# EAGLE design board (EAGLE 9.3.2)
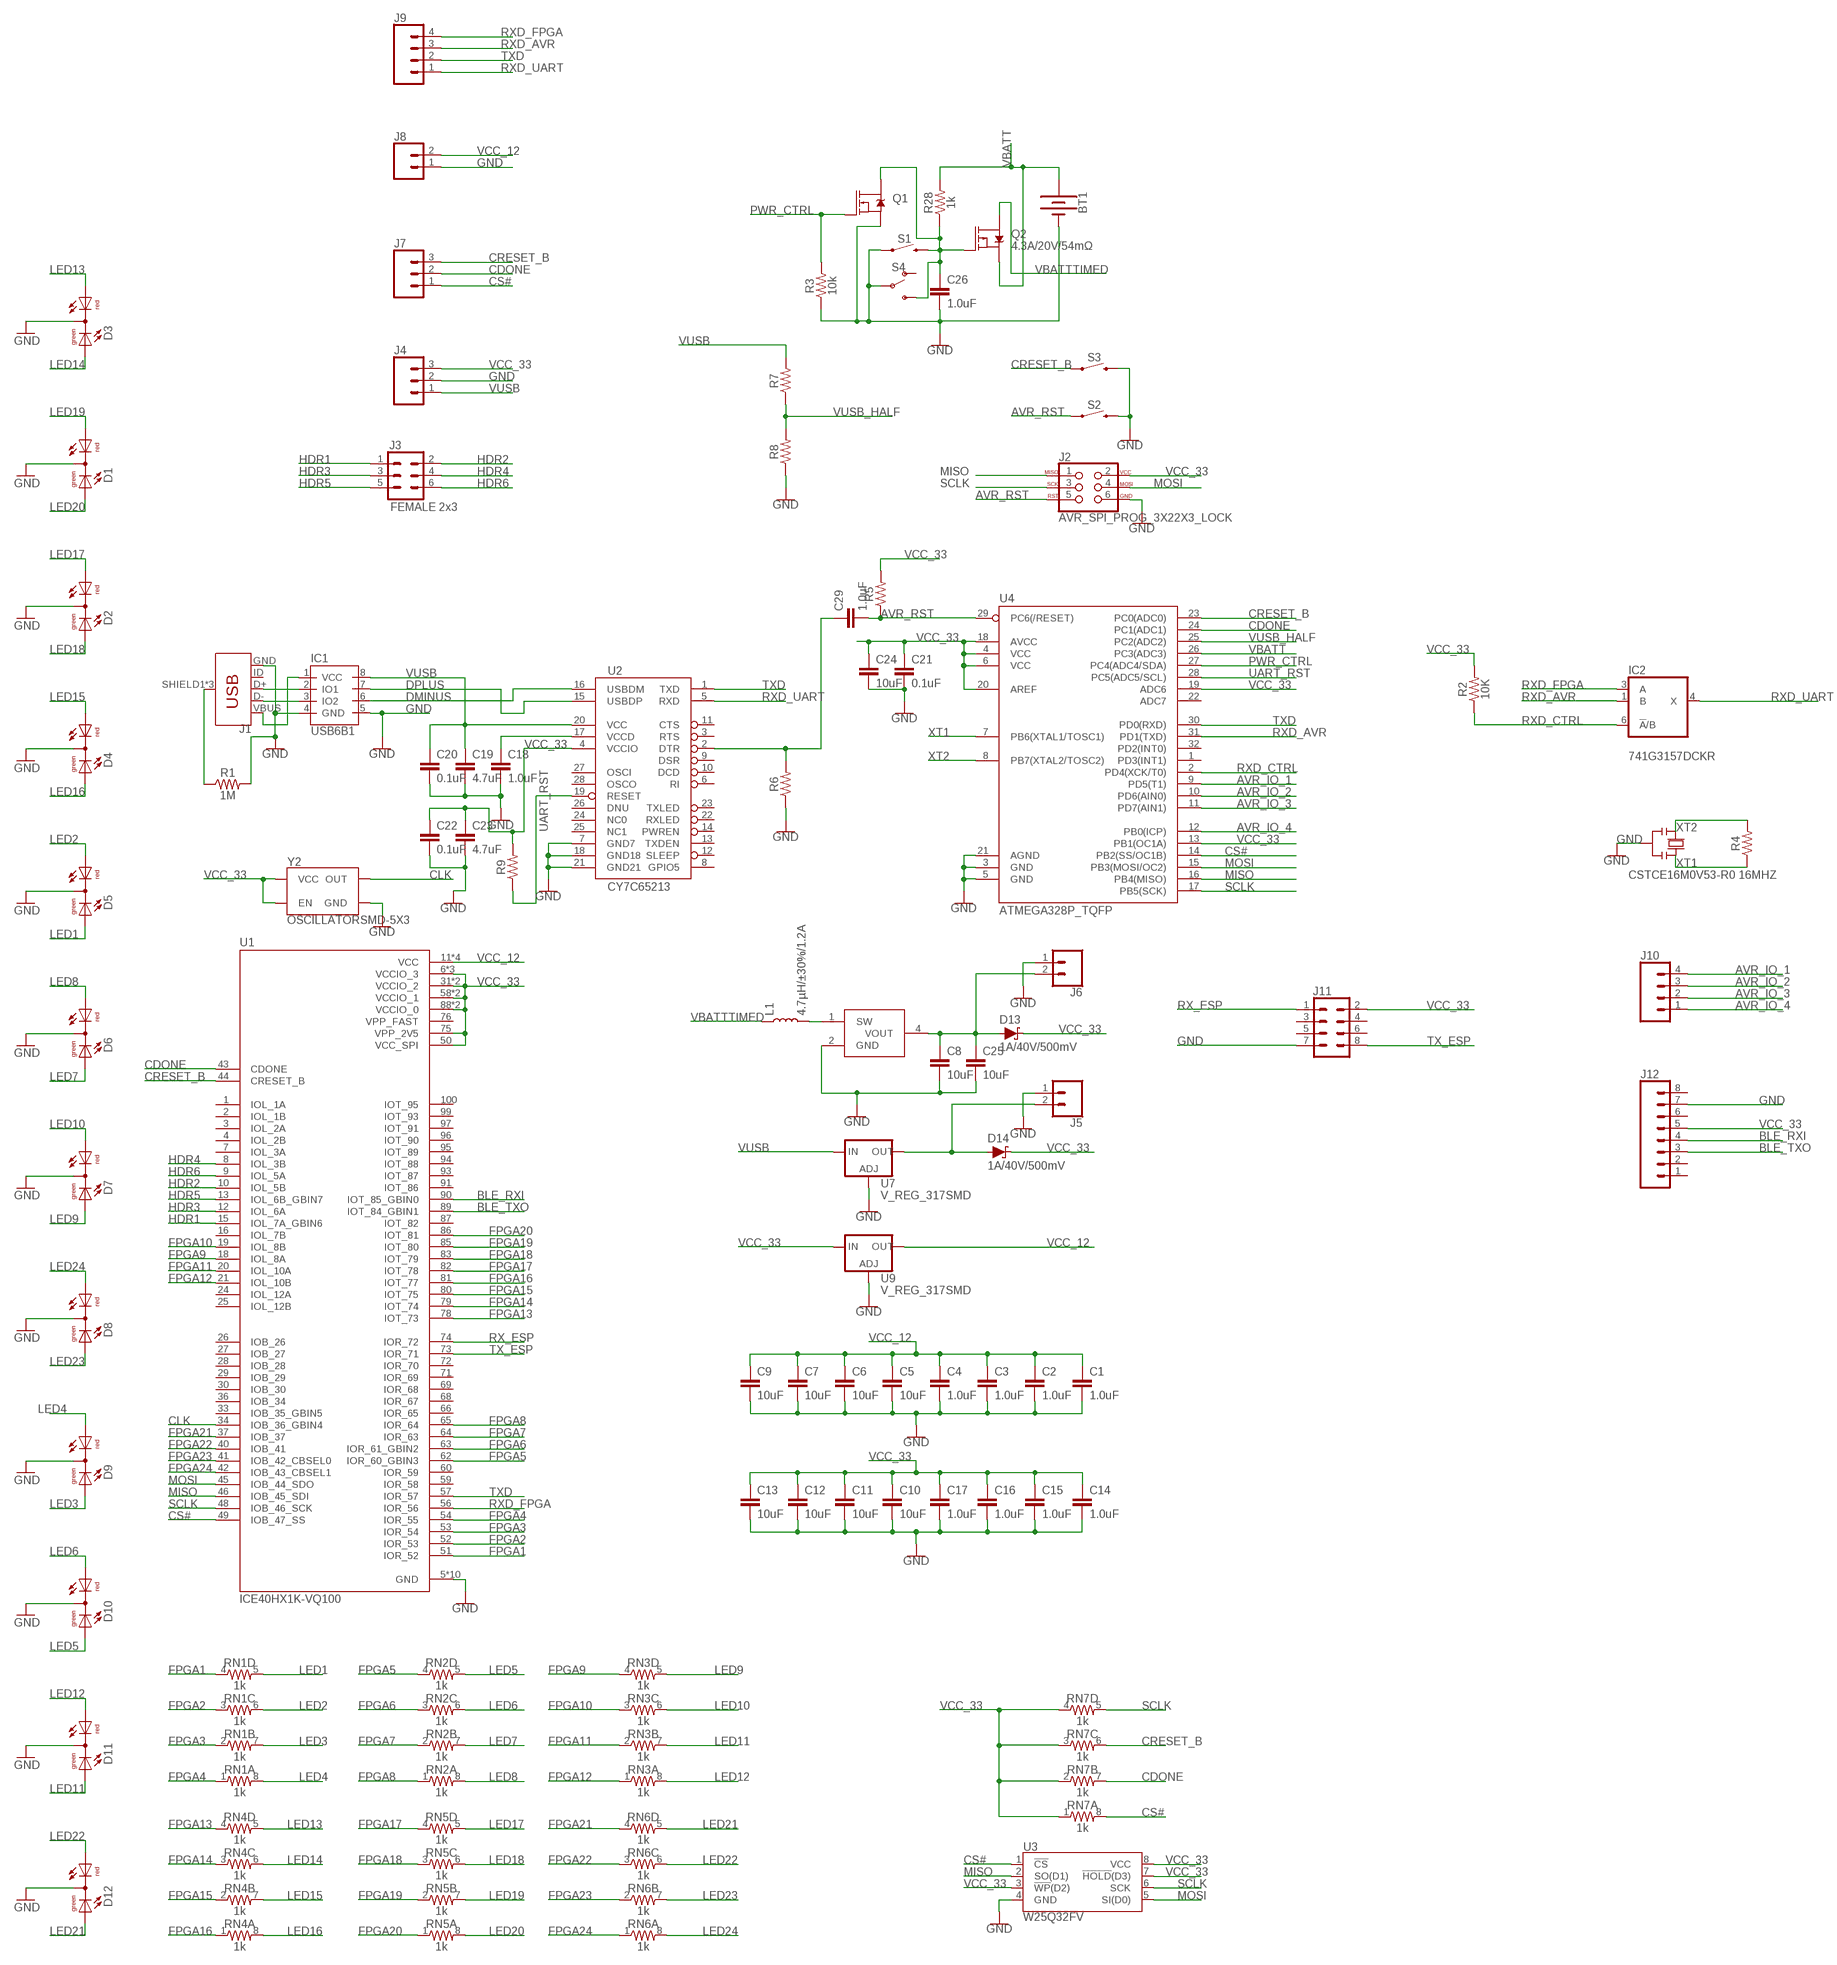
[diagram p0: schematic, sheet 1]

## Parts
BT1  BATTERY-20MM_SMD  [BATTCON_20MM]
C1  1.0uF  1.0UF-0805-25V-10%  [0805]
C2  1.0uF  1.0UF-0805-25V-10%  [0805]
C3  1.0uF  1.0UF-0805-25V-10%  [0805]
C4  1.0uF  1.0UF-0805-25V-10%  [0805]
C5  10uF  10UF-0805-10V-10%  [0805]
C6  10uF  10UF-0805-10V-10%  [0805]
C7  10uF  10UF-0805-10V-10%  [0805]
C8  10uF  22UF-0805-6.3V-20%  [0805]
C9  10uF  10UF-0805-10V-10%  [0805]
C10  10uF  10UF-0805-10V-10%  [0805]
C11  10uF  10UF-0805-10V-10%  [0805]
C12  10uF  10UF-0805-10V-10%  [0805]
C13  10uF  10UF-0805-10V-10%  [0805]
C14  1.0uF  1.0UF-0805-25V-(+80/-20%)  [0805]
C15  1.0uF  1.0UF-0805-25V-(+80/-20%)  [0805]
C16  1.0uF  1.0UF-0805-25V-(+80/-20%)  [0805]
C17  1.0uF  1.0UF-0805-25V-(+80/-20%)  [0805]
C18  1.0uF  1.0UF-0805-25V-10%  [0805]
C19  4.7uF  10UF-0805-10V-10%  [0805]
C20  0.1uF  1.0UF-0805-25V-10%  [0805]
C21  0.1uF  1.0UF-0805-25V-10%  [0805]
C22  0.1uF  1.0UF-0805-25V-10%  [0805]
C23  4.7uF  1.0UF-0805-25V-10%  [0805]
C24  10uF  1.0UF-0805-25V-10%  [0805]
C25  10uF  1.0UF-0805-25V-10%  [0805]
C26  1.0uF  1.0UF-0603-16V-10%  [0603]
C29  1.0uF  1.0UF-0805-25V-(+80/-20%)  [0805]
D1  DUOLED5MM  [DUOLED5MM]
D2  DUOLED5MM  [DUOLED5MM]
D3  DUOLED5MM  [DUOLED5MM]
D4  DUOLED5MM  [DUOLED5MM]
D5  DUOLED5MM  [DUOLED5MM]
D6  DUOLED5MM  [DUOLED5MM]
D7  DUOLED5MM  [DUOLED5MM]
D8  DUOLED5MM  [DUOLED5MM]
D9  DUOLED5MM  [DUOLED5MM]
D10  DUOLED5MM  [DUOLED5MM]
D11  DUOLED5MM  [DUOLED5MM]
D12  DUOLED5MM  [DUOLED5MM]
D13  1A/40V/500mV  DIODE-SCHOTTKY-SS14  [SMA-DIODE]
D14  1A/40V/500mV  DIODE-SCHOTTKY-SS14  [SMA-DIODE]
IC1  USB6B1  [SO08]
IC2  741G3157DCKR  [DCK_R-PDSO-G6]
J1  USB_MICRO-B_FEMALE-SMT  [USB-B-MICRO-SMD]
J2  AVR_SPI_PROG_3X22X3_LOCK  [2X3_LOCK]
J3  FEMALE 2x3  CONN_03X2FEMALE  [2X3]
J4  CONN_03LOCK  [1X03_LOCK]
J5  CONN_02LOCK  [1X02_LOCK]
J6  CONN_02LOCK  [1X02_LOCK]
J7  CONN_03LOCK  [1X03_LOCK]
J8  CONN_02LOCK  [1X02_LOCK]
J9  CONN_04LOCK  [1X04_LOCK]
J10  CONN_04LOCK  [1X04_LOCK]
J11  CONN_04X2  [2X4]
J12  CONN_08LOCK  [1X08_LOCK]
L1  4.7µH/±30%/1.2A  INDUCTOR-CDRH-4.7UH  [INDUCTOR_4.7UH]
Q1  5.8A/30V/35mΩ  MOSFET-NCH-AO3404A  [SOT23-3]
Q2  4.3A/20V/54mΩ  MOSFET_PCH-IRLML2244  [SOT23-3]
R1  1M  RESISTOR0805  [0805]
R2  10K  RESISTOR0805  [0805]
R3  10k  RESISTOR0805  [0805]
R4  RESISTOR0805  [0805]
R5  RESISTOR0805  [0805]
R6  RESISTOR0805  [0805]
R7  RESISTOR0805  [0805]
R8  RESISTOR0805  [0805]
R9  RESISTOR0805  [0805]
R28  1k  1KOHM-0603-1/10W-1%  [0603]
RN1  1k  1KOHM-ARRAY(4)-0805_ARV-1/10W-5%  [0805-ARV]
RN2  1k  1KOHM-ARRAY(4)-0805_ARV-1/10W-5%  [0805-ARV]
RN3  1k  1KOHM-ARRAY(4)-0805_ARV-1/10W-5%  [0805-ARV]
RN4  1k  1KOHM-ARRAY(4)-0805_ARV-1/10W-5%  [0805-ARV]
RN5  1k  1KOHM-ARRAY(4)-0805_ARV-1/10W-5%  [0805-ARV]
RN6  1k  1KOHM-ARRAY(4)-0805_ARV-1/10W-5%  [0805-ARV]
RN7  1k  1KOHM-ARRAY(4)-0805_ARV-1/10W-5%  [0805-ARV]
S1  MOMENTARY-SWITCH-SPST-SMD-5.2MM  [TACTILE_SWITCH_SMD_5.2MM]
S2  MOMENTARY-SWITCH-SPST-SMD-5.2MM  [TACTILE_SWITCH_SMD_5.2MM]
S3  MOMENTARY-SWITCH-SPST-SMD-5.2MM  [TACTILE_SWITCH_SMD_5.2MM]
S4  SWITCH-SPDT-PTH-11.6X4.0MM  [SWITCH_SPDT_PTH_11.6X4.0MM]
U1  ICE40HX1K-VQ100  [QFP50P1600X1600X120-100N]
U2  CY7C65213  [SSOP28DB]
U3  W25Q32FV  W25Q32FVSS  [SOIC-8]
U4  ATMEGA328P_TQFP  [TQFP32-08]
U7  V_REG_317SMD  [SOT223]
U9  V_REG_317SMD  [SOT223]
U$2  TPS613221A  [SOT95P280X145-5N]
Y1  CSTCE16M0V53-R0 16MHZ  RESONATORMU  [RESONATOR]
Y2  OSCILLATORSMD-5X3  [OSCILLATOR-SMD-5X3.2]

## Nets
AVR_IO_1: J10.4 U4.9(PD5(T1))
AVR_IO_2: J10.3 U4.10(PD6(AIN0))
AVR_IO_3: J10.2 U4.11(PD7(AIN1))
AVR_IO_4: J10.1 U4.12(PB0(ICP))
AVR_RST: C29.2 J2.5 R5.1 S2.1 U4.29(PC6(/RESET))
BLE_RXI: J12.4 U1.90(IOT_85_GBIN0)
BLE_TXO: J12.3 U1.89(IOT_84_GBIN1)
CDONE: J7.2 RN7.7 U1.43(CDONE) U4.24(PC1(ADC1))
CLK: U1.34(IOB_36_GBIN4) Y2.3(OUT)
CRESET_B: J7.3 RN7.6 S3.1 U1.44(CRESET_B) U4.23(PC0(ADC0))
CS#: J7.1 RN7.8 U1.49(IOB_47_SS) U3.1(!CS!) U4.14(PB2(SS/OC1B))
DMINUS: IC1.6(IO2) U2.16(USBDM)
DPLUS: IC1.7(IO1) U2.15(USBDP)
FPGA1: RN1.4 U1.51(IOR_52)
FPGA2: RN1.3 U1.52(IOR_53)
FPGA3: RN1.2 U1.53(IOR_54)
FPGA4: RN1.1 U1.54(IOR_55)
FPGA5: RN2.4 U1.62(IOR_60_GBIN3)
FPGA6: RN2.3 U1.63(IOR_61_GBIN2)
FPGA7: RN2.2 U1.64(IOR_63)
FPGA8: RN2.1 U1.65(IOR_64)
FPGA9: RN3.4 U1.18(IOL_8A)
FPGA10: RN3.3 U1.19(IOL_8B)
FPGA11: RN3.2 U1.20(IOL_10A)
FPGA12: RN3.1 U1.21(IOL_10B)
FPGA13: RN4.4 U1.78(IOT_73)
FPGA14: RN4.3 U1.79(IOT_74)
FPGA15: RN4.2 U1.80(IOT_75)
FPGA16: RN4.1 U1.81(IOT_77)
FPGA17: RN5.4 U1.82(IOT_78)
FPGA18: RN5.3 U1.83(IOT_79)
FPGA19: RN5.2 U1.85(IOT_80)
FPGA20: RN5.1 U1.86(IOT_81)
FPGA21: RN6.4 U1.37(IOB_37)
FPGA22: RN6.3 U1.40(IOB_41)
FPGA23: RN6.2 U1.41(IOB_42_CBSEL0)
FPGA24: RN6.1 U1.42(IOB_43_CBSEL1)
GND: BT1.2(-) C1.2 C2.2 C3.2 C4.2 C5.2 C6.2 C7.2 C8.2 C9.2 C10.2 C11.2 C12.2 C13.2 C14.2 C15.2 C16.2 C17.2 C18.2 C19.2 C20.2 C21.2 C22.2 C23.2 C24.2 C25.2 C26.2 D1.K(C) D2.K(C) D3.K(C) D4.K(C) D5.K(C) D6.K(C) D7.K(C) D8.K(C) D9.K(C) D10.K(C) D11.K(C) D12.K(C) IC1.4(GND) IC1.5(GND) J1.GND J2.6 J4.2 J5.1 J6.1 J8.1 J11.7 J12.7 Q1.2(S) R1.2 R3.1 R6.1 R8.1 S1.1 S2.3 S3.3 S4.2(P) U1.5(GND) U1.17(GND) U1.23(GND) U1.32(GND) U1.39(GND) U1.47(GND) U1.55(GND) U1.70(GND) U1.84(GND) U1.98(GND) U2.7(GND7) U2.18(GND18) U2.21(GND21) U3.4(GND) U4.3(GND) U4.5(GND) U4.21(AGND) U7.1(ADJ) U9.1(ADJ) U$2.2(GND) Y1.2 Y2.2(GND)
HDR1: J3.1 U1.15(IOL_7A_GBIN6)
HDR2: J3.2 U1.10(IOL_5B)
HDR3: J3.3 U1.12(IOL_6A)
HDR4: J3.4 U1.8(IOL_3B)
HDR5: J3.5 U1.13(IOL_6B_GBIN7)
HDR6: J3.6 U1.9(IOL_5A)
LED1: D5.AG RN1.5
LED2: D5.AR RN1.6
LED3: D9.AG RN1.7
LED4: D9.AR RN1.8
LED5: D10.AG RN2.5
LED6: D10.AR RN2.6
LED7: D6.AG RN2.7
LED8: D6.AR RN2.8
LED9: D7.AG RN3.5
LED10: D7.AR RN3.6
LED11: D11.AG RN3.7
LED12: D11.AR RN3.8
LED13: D3.AR RN4.5
LED14: D3.AG RN4.6
LED15: D4.AR RN4.7
LED16: D4.AG RN4.8
LED17: D2.AR RN5.5
LED18: D2.AG RN5.6
LED19: D1.AR RN5.7
LED20: D1.AG RN5.8
LED21: D12.AG RN6.5
LED22: D12.AR RN6.6
LED23: D8.AG RN6.7
LED24: D8.AR RN6.8
MISO: J2.1 U1.46(IOB_45_SDI) U3.2(SO(D1)) U4.16(PB4(MISO))
MOSI: J2.4 U1.45(IOB_44_SDO) U3.5(SI(D0)) U4.15(PB3(MOSI/OC2))
N$1: C29.1 R6.2 U2.2(DTR)
N$2: C8.1 C25.1 D13.A J6.2 U$2.4(VOUT)
N$3: C18.1 U2.17(VCCD)
N$4: J1.SHIELD1(SHIELD) J1.SHIELD2(SHIELD) J1.SHIELD3(SHIELD) R1.1
N$6: C26.1 Q1.3(D) Q2.1(G) R28.1 S1.3 S4.3(S)
N$29: D14.A J5.2 U7.2(OUT)
N$30: IC1.2(IO1) J1.D+
N$31: IC1.3(IO2) J1.D-
N$32: L1.P$2 U$2.1(SW)
N$33: IC1.1(VCC) J1.VBUS
PWR_CTRL: Q1.1(G) R3.2 U4.27(PC4(ADC4/SDA))
RX_ESP: J11.1 U1.74(IOR_72)
RXD_AVR: IC2.1(B) J9.3 U4.31(PD1(TXD))
RXD_CTRL: IC2.6(!A!/B) R2.1 U4.2(PD4(XCK/T0))
RXD_FPGA: IC2.3(A) J9.4 U1.56(IOR_56)
RXD_UART: IC2.4(X) J9.1 U2.5(RXD)
SCLK: J2.3 RN7.5 U1.48(IOB_46_SCK) U3.6(SCK) U4.17(PB5(SCK))
TX_ESP: J11.8 U1.73(IOR_71)
TXD: J9.2 U1.57(IOR_57) U2.1(TXD) U4.30(PD0(RXD))
UART_RST: R9.1 U2.19(RESET) U4.28(PC5(ADC5/SCL))
VBATT: BT1.1(+) Q2.2(S) R28.2 U4.26(PC3(ADC3))
VBATTTIMED: L1.P$1 Q2.3(D)
VCC_12: C1.1 C2.1 C3.1 C4.1 C5.1 C6.1 C7.1 C9.1 J8.2 U1.11(VCC) U1.35(VCC) U1.61(VCC) U1.77(VCC) U9.2(OUT)
VCC_33: C10.1 C11.1 C12.1 C13.1 C14.1 C15.1 C16.1 C17.1 C21.1 C22.1 C23.1 C24.1 D13.C D14.C J2.2 J4.3 J11.2 J12.5 R2.2 R5.2 R9.2 RN7.1 RN7.2 RN7.3 RN7.4 U1.6(VCCIO_3) U1.14(VCCIO_3) U1.22(VCCIO_3) U1.31(VCCIO_2) U1.38(VCCIO_2) U1.50(VCC_SPI) U1.58(VCCIO_1) U1.67(VCCIO_1) U1.75(VPP_2V5) U1.88(VCCIO_0) U1.92(VCCIO_0) U2.4(VCCIO) U3.3(!WP!(D2)) U3.7(!HOLD!(D3)) U3.8(VCC) U4.4(VCC) U4.6(VCC) U4.13(PB1(OC1A)) U4.18(AVCC) U4.19(ADC6) U4.20(AREF) U9.3(IN) Y2.1(EN) Y2.4(VCC)
VUSB: C19.1 C20.1 IC1.8(VCC) J4.1 R7.2 U2.20(VCC) U7.3(IN)
VUSB_HALF: R7.1 R8.2 U4.25(PC2(ADC2))
XT1: R4.1 U4.7(PB6(XTAL1/TOSC1)) Y1.3
XT2: R4.2 U4.8(PB7(XTAL2/TOSC2)) Y1.1
Unconnected: J1.ID J11.3 J11.4 J11.5 J11.6 J12.1 J12.2 J12.6 J12.8 S4.1(O) U1.1(IOL_1A) U1.2(IOL_1B) U1.3(IOL_2A) U1.4(IOL_2B) U1.7(IOL_3A) U1.16(IOL_7B) U1.24(IOL_12A) U1.25(IOL_12B) U1.26(IOB_26) U1.27(IOB_27) U1.28(IOB_28) U1.29(IOB_29) U1.30(IOB_30) U1.33(IOB_35_GBIN5) U1.36(IOB_34) U1.59(IOR_58) U1.60(IOR_59) U1.66(IOR_65) U1.68(IOR_67) U1.69(IOR_68) U1.71(IOR_69) U1.72(IOR_70) U1.87(IOT_82) U1.91(IOT_86) U1.93(IOT_87) U1.94(IOT_88) U1.95(IOT_89) U1.96(IOT_90) U1.97(IOT_91) U1.99(IOT_93) U1.100(IOT_95) U2.3(RTS) U2.6(RI) U2.8(GPIO5) U2.9(DSR) U2.10(DCD) U2.11(CTS) U2.12(SLEEP) U2.13(TXDEN) U2.14(PWREN) U2.22(RXLED) U2.23(TXLED) U2.24(NC0) U2.26(DNU) U2.27(OSCI) U2.28(OSCO) U4.1(PD3(INT1)) U4.22(ADC7) U4.32(PD2(INT0))

## Power pins joined to a net without a drawn wire
GND: IC2.2(GND)
NC1: U2.25(NC1)
VCC_33: IC2.5(VCC)
VPP_FAST: U1.76(VPP_FAST)

## Library data of the parts
BT1 = SparkFun-Batteries:BATTERY: Battery - Single Cell A variety of battery chemistries, sizes, and footprints. Device List: 20MM_PTH - Coin Cell Battery Holder - 20mm (PTH) <https://www.sparkfun.com/products/783> 6.8MM_PTH - Coin Cell Battery Holder - 6.8MM(SMD) <https://www.digikey.com/product-detail/en/seiko-instruments/MS621FE-FL11E/728-1057-ND/1889208?WT.srch=1&gclid=CNOQ5a6LzdQCFZS2wAodXCkE0g> 12MM_SMD - Coin Cell Battery Holder - 12mm (SMD) <https://www.sparkfun.com/products/10592> 12MM_PTH - Coin Cell Battery Holder - 12mm (PTH) <https://www.sparkfun.com/products/7948> 20MM_SMD - 20mm Coin Cell Battery Holder (SMD) (2 legs) Used on the Big Time Watch Kit <https://www.sparkfun.com/products/11734> 20MM_SMD_4LEGS - Coin Cell Battery Holder - 20mm (SMD) <https://www.sparkfun.com/products/11892> 20MM_SMD_4LEGS_OVERPASTE - Coin Cell Battery Holder - 20mm (SMD) <https://www.sparkfun.com/products/11892> (Over-paste on the legs) 24.5MM_PTH - Coin Cell Battery Holder - 24.5mm (PTH) <https://www.sparkfun.com/products/8863> 9V - 9V Battery Holder - PC Mount Used on the SparkFun SparkPunk Sound Kit <https://www.sparkfun.com/products/11177> and SparkFun SparkPunk Sequencer Kit <https://www.sparkfun.com/products/12707> 18650 - Battery Holder - 18650 (PTH) <https://www.sparkfun.com/products/13113> AA - Battery Holder - 1xAA (PTH) <https://www.sparkfun.com/products/7949> AAA - Battery Holder - 1xAAA (PTH) <https://www.sparkfun.com/products/12718> AA_KIT - Battery Holder - 1xAA (PTH) <https://www.sparkfun.com/products/7949> Special kit package - pads only have exposed copper on one side of the board. AAA_KIT - Battery Holder - 1xAAA (PTH) <https://www.sparkfun.com/products/12718> Special kit package - pads only have exposed copper on one side of the board.; PROD_ID: BATT-11519
C1-C4 C18 = SparkFun-Capacitors:1.0UF: 1µF ceramic capacitors A capacitor is a passive two-terminal electrical component used to store electrical energy temporarily in an electric field.; PROD_ID: CAP-08064
C5-C7 C9-C13 = SparkFun-Capacitors:10UF: 10.0µF ceramic capacitors A capacitor is a passive two-terminal electrical component used to store electrical energy temporarily in an electric field.; PROD_ID: CAP-11330
C8 = SparkFun-Capacitors:22UF: 22µF ceramic capacitors A capacitor is a passive two-terminal electrical component used to store electrical energy temporarily in an electric field.; PROD_ID: CAP-08402; VALUE: 22uF
C14-C17 C29 = SparkFun-Capacitors:1.0UF: 1µF ceramic capacitors A capacitor is a passive two-terminal electrical component used to store electrical energy temporarily in an electric field.; PROD_ID: CAP-11625
C19 = SparkFun-Capacitors:10UF: 10.0µF ceramic capacitors A capacitor is a passive two-terminal electrical component used to store electrical energy temporarily in an electric field.; PROD_ID: CAP-11330; VALUE: 10uF
C20-C25 = SparkFun-Capacitors:1.0UF: 1µF ceramic capacitors A capacitor is a passive two-terminal electrical component used to store electrical energy temporarily in an electric field.; PROD_ID: CAP-08064; VALUE: 1.0uF
C26 = SparkFun-Capacitors:1.0UF: 1µF ceramic capacitors A capacitor is a passive two-terminal electrical component used to store electrical energy temporarily in an electric field.; PROD_ID: CAP-00868
D1-D12 = led:DUOLED5MM: DUO LED 2 colors, 5 mm, round
D13 D14 = SparkFun-DiscreteSemi:DIODE-SCHOTTKY: Schottky diode A Schottky diode is a semiconductor diode which has a low forward voltage drop and a very fast switching action.; PROD_ID: DIO-08053
IC1 = st-microelectronics:USB6B1: DATA LINES PROTECTION Source: http://www.st.com/stonline/products/literature/ds/5605.pdf; MPN: USB6B1; OC_FARNELL: 9804358; OC_NEWARK: 26M4750
IC2 = 74xx-little-us:74*1G3157: Single-Pole, Double-Throw Analog Switch Source: http://focus.ti.com/lit/ds/symlink/sn74lvc1g3157.pdf
J1 = SparkFun-Connectors:USB_MICRO-B: USB Type Micro-B Connector Male/female and PTH/SMT variants SparkFun Products: SparkFun microB USB Breakout <https://www.sparkfun.com/products/12035> SparkFun USB microB Plug Breakout <https://www.sparkfun.com/products/10031> SparkFun ESP8266 Thing <https://www.sparkfun.com/products/13231>; PROD_ID: CONN-11752
J2 = SparkFun-Connectors:AVR_SPI_PROG_3X2: AVR ISP 6 Pin This is the reduced ISP connector for AVR programming. Common on Arduino. This footprint will take up less PCB space and can be used with a 10-pin to 6-pin adapter such as SKU: BOB-08508 **Special note about "TEST_POINT" package. The stop mask is on the top side, so if you want your programming test points to be on the bottom of your board, make sure to place this package on the bottom side of the board. This also ensure that the orientation to program from the bottom side will be correct. SparkFun Products: SparkFun ISP Pogo Adapter <https://www.sparkfun.com/products/11591> - NS Tiny AVR Programmer <https://www.sparkfun.com/products/11801> -PTH
J3 = SparkFun-Connectors:CONN_03X2: Multi connection point. Often used as Generic Header-pin footprint for 0.1 inch spaced/style header connections You can populate with any combo of single row headers, but if you'd like an exact match, check these: Header - 2x3 (Male, 0.1") <https://www.sparkfun.com/products/12807> (PRT-12807) Header - 2x3 (Female, 0.1") <https://www.sparkfun.com/products/13010> (PRT-13010) 2x3 Pin Shrouded Header <https://www.sparkfun.com/products/10877> (PRT-10877) On any of the 0.1 inch spaced packages, you can populate with these: Break Away Headers - Straight <https://www.sparkfun.com/products/116> (PRT-00116) Break Away Male Headers - Right Angle <https://www.sparkfun.com/products/553> (PRT-00553) Female Headers <https://www.sparkfun.com/products/115> (PRT-00115) Break Away Headers - Machine Pin <https://www.sparkfun.com/products/117> (PRT-00117) Break Away Female Headers - Swiss Machine Pin <https://www.sparkfun.com/products/743> (PRT-00743) Special note: the shrouded connector mates well with our 3x2 ribbon cables: Ribbon Crimp Connector - 6-pin (2x3, Female) <https://www.sparkfun.com/products/10651> (PRT-10651) Ribbon Cable - 6 wire (15ft) <https://www.sparkfun.com/products/10646> (PRT-10646); PROD_ID: CONN-11566
J4 J7 = SparkFun-Connectors:CONN_03: Multi connection point. Often used as Generic Header-pin footprint for 0.1 inch spaced/style header connections On any of the 0.1 inch spaced packages, you can populate with these: Break Away Headers - Straight <https://www.sparkfun.com/products/116> (PRT-00116) Break Away Male Headers - Right Angle <https://www.sparkfun.com/products/553> (PRT-00553) Female Headers <https://www.sparkfun.com/products/115> (PRT-00115) Break Away Headers - Machine Pin <https://www.sparkfun.com/products/117> (PRT-00117) Break Away Female Headers - Swiss Machine Pin <https://www.sparkfun.com/products/743> (PRT-00743) Stackable Header - 3 Pin (Female, 0.1") <https://www.sparkfun.com/products/13875> (PRT-13875) For SCREWTERMINALS and SPRING TERMINALS visit here: Screw Terimnals on SparkFun.com <https://www.sparkfun.com/search/results?term=Screw+Terminals> (5mm/3.5mm/2.54mm spacing) This device is also useful as a general connection point to wire up your design to another part of your project. Our various solder wires solder well into these plated through hole pads. Hook-Up Wire - Assortment (Stranded, 22 AWG) <https://www.sparkfun.com/products/11375> (PRT-11375) Hook-Up Wire - Assortment (Solid Core, 22 AWG) <https://www.sparkfun.com/products/11367> (PRT-11367) View the entire wire category on our website here <https://www.sparkfun.com/categories/141> Special notes: Molex polarized connector foot print use with SKU : PRT-08232 with associated crimp pins and housings.
J5 J6 J8 = SparkFun-Connectors:CONN_02: Multi connection point. Often used as Generic Header-pin footprint for 0.1 inch spaced/style header connections On any of the 0.1 inch spaced packages, you can populate with these: Break Away Headers - Straight <https://www.sparkfun.com/products/116> (PRT-00116) Break Away Male Headers - Right Angle <https://www.sparkfun.com/products/553> (PRT-00553) Female Headers <https://www.sparkfun.com/products/115> (PRT-00115) Break Away Headers - Machine Pin <https://www.sparkfun.com/products/117> (PRT-00117) Break Away Female Headers - Swiss Machine Pin <https://www.sparkfun.com/products/743> (PRT-00743) For SCREWTERMINALS and SPRING TERMINALS visit here: Screw Terimnals on SparkFun.com <https://www.sparkfun.com/search/results?term=Screw+Terminals> (5mm/3.5mm/2.54mm spacing) This device is also useful as a general connection point to wire up your design to another part of your project. Our various solder wires solder well into these plated through hole pads. Hook-Up Wire - Assortment (Stranded, 22 AWG) <https://www.sparkfun.com/products/11375> (PRT-11375) Hook-Up Wire - Assortment (Solid Core, 22 AWG) <https://www.sparkfun.com/products/11367> (PRT-11367) View the entire wire category on our website here <https://www.sparkfun.com/categories/141> Special notes: Molex polarized connector foot print use with: PRT-08233 with associated crimp pins and housings. 2.54_SCREWTERM for use with PRT-10571. 3.5mm Screw Terminal footprints for PRT-08084 5mm Screw Terminal footprints for use with PRT-08432
J9 J10 = SparkFun-Connectors:CONN_04: Multi connection point. Often used as Generic Header-pin footprint for 0.1 inch spaced/style header connections On any of the 0.1 inch spaced packages, you can populate with these: Break Away Headers - Straight <https://www.sparkfun.com/products/116> (PRT-00116) Break Away Male Headers - Right Angle <https://www.sparkfun.com/products/553> (PRT-00553) Female Headers <https://www.sparkfun.com/products/115> (PRT-00115) Break Away Headers - Machine Pin <https://www.sparkfun.com/products/117> (PRT-00117) Break Away Female Headers - Swiss Machine Pin <https://www.sparkfun.com/products/743> (PRT-00743) For SCREWTERMINALS and SPRING TERMINALS visit here: Screw Terimnals on SparkFun.com <https://www.sparkfun.com/search/results?term=Screw+Terminals> (5mm/3.5mm/2.54mm spacing) This device is also useful as a general connection point to wire up your design to another part of your project. Our various solder wires solder well into these plated through hole pads. Hook-Up Wire - Assortment (Stranded, 22 AWG) <https://www.sparkfun.com/products/11375> (PRT-11375) Hook-Up Wire - Assortment (Solid Core, 22 AWG) <https://www.sparkfun.com/products/11367> (PRT-11367) View the entire wire category on our website here <https://www.sparkfun.com/categories/141> Special notes: Molex polarized connector foot print use with SKU : PRT-08231 with associated crimp pins and housings. 1MM SMD Version SKU: PRT-10208; PROD_ID: CONN-09696
J11 = SparkFun-Connectors:CONN_04X2: Multi connection point. Often used as Generic Header-pin footprint for 0.1 inch spaced/style header connections On any of the 0.1 inch spaced packages, you can populate with these: Break Away Headers - Straight <https://www.sparkfun.com/products/116> (PRT-00116) Break Away Male Headers - Right Angle <https://www.sparkfun.com/products/553> (PRT-00553) Female Headers <https://www.sparkfun.com/products/115> (PRT-00115) Break Away Headers - Machine Pin <https://www.sparkfun.com/products/117> (PRT-00117) Break Away Female Headers - Swiss Machine Pin <https://www.sparkfun.com/products/743> (PRT-00743)
J12 = SparkFun-Connectors:CONN_08: Multi connection point. Often used as Generic Header-pin footprint for 0.1 inch spaced/style header connections On any of the 0.1 inch spaced packages, you can populate with these: Break Away Headers - Straight <https://www.sparkfun.com/products/116> (PRT-00116) Break Away Male Headers - Right Angle <https://www.sparkfun.com/products/553> (PRT-00553) Female Headers <https://www.sparkfun.com/products/115> (PRT-00115) Break Away Headers - Machine Pin <https://www.sparkfun.com/products/117> (PRT-00117) Break Away Female Headers - Swiss Machine Pin <https://www.sparkfun.com/products/743> (PRT-00743) Arduino Stackable Header - 8 Pin <https://www.sparkfun.com/products/9279> (PRT-09279) For SCREWTERMINALS and SPRING TERMINALS visit here: Screw Terimnals on SparkFun.com <https://www.sparkfun.com/search/results?term=Screw+Terminals> (5mm/3.5mm/2.54mm spacing) This device is also useful as a general connection point to wire up your design to another part of your project. Our various solder wires solder well into these plated through hole pads. Hook-Up Wire - Assortment (Stranded, 22 AWG) <https://www.sparkfun.com/products/11375> (PRT-11375) Hook-Up Wire - Assortment (Solid Core, 22 AWG) <https://www.sparkfun.com/products/11367> (PRT-11367) View the entire wire category on our website here <https://www.sparkfun.com/categories/141> Special notes: Molex polarized connector foot print use with SKU : PRT-08231 with associated crimp pins and housings. 1MM SMD Version SKU: PRT-10208 NOTES ON THE VARIANTS LOCK and LOCK_LONGPADS... This footprint was designed to help hold the alignment of a through-hole component (i.e. 6-pin header) while soldering it into place. You may notice that each hole has been shifted either up or down by 0.005 of an inch from it's more standard position (which is a perfectly straight line). This slight alteration caused the pins (the squares in the middle) to touch the edges of the holes. Because they are alternating, it causes a "brace" to hold the component in place. 0.005 has proven to be the perfect amount of "off-center" position when using our standard breakaway headers. Although looks a little odd when you look at the bare footprint, once you have a header in there, the alteration is very hard to notice. Also,if you push a header all the way into place, it is covered up entirely on the bottom side.
L1 = SparkFun-Coils:INDUCTOR: Inductors Resist changes in electrical current. Basically a coil of wire. SparkFun Products: SparkFun Load Cell Amplifier - HX711 <https://www.sparkfun.com/products/13879> IOIO-OTG - V2.2 <https://www.sparkfun.com/products/13613>; PROD_ID: NDUC-10146
Q1 = SparkFun-DiscreteSemi:MOSFET-NCH: N-channel MOSFETs Voltage controlled devices that allow control of high current outputs. SparkFun Products: SparkFun OpenScale <https://www.sparkfun.com/products/13261> SparkFun Digital Sandbox <https://www.sparkfun.com/products/12651> SparkFun Monster Moto Shield <https://www.sparkfun.com/products/10182> SparkFun MOSFET Power Controller <https://www.sparkfun.com/products/11214>; PROD_ID: TRANS-12988
Q2 = SparkFun-DiscreteSemi:MOSFET_PCH: P-channel MOSFETs Voltage controlled devices that allow control of high current outputs. SparkFun Products: SparkFun ESP32 Thing <https://www.sparkfun.com/products/13907> SparkFun ESP8266 Thing <https://www.sparkfun.com/products/13231>; PROD_ID: TRANS-11153
R1-R9 = SparkFun-Resistors:RESISTOR: Generic Resistor Package
R28 = SparkFun-Resistors:1KOHM: 1kΩ resistor A resistor is a passive two-terminal electrical component that implements electrical resistance as a circuit element. Resistors act to reduce current flow, and, at the same time, act to lower voltage levels within circuits. - Wikipedia; PROD_ID: RES-07856
RN1-RN7 = SparkFun-Resistors:1KOHM-ARRAY(4): 4 x 1kΩ resistor array A resistor is a passive two-terminal electrical component that implements electrical resistance as a circuit element. Resistors act to reduce current flow, and, at the same time, act to lower voltage levels within circuits. - Wikipedia An array is a collection of discrete resistors in a single package.; PROD_ID: RES-13020
S1-S3 = SparkFun-Switches:MOMENTARY-SWITCH-SPST: Momentary Switch (Pushbutton) - SPST Normally-open (NO) SPST momentary switches (buttons, pushbuttons). Variants PTH-12MM - 12mm square, through-hole Momentary Pushbutton Switch - 12mm Square <https://www.sparkfun.com/products/9190> (COM-09190) PTH-6.0MM, PTH-6.0MM-KIT - 6.0mm square, through-hole Mini Pushbutton Switch <https://www.sparkfun.com/products/97> (COM-00097) KIT package intended for soldering kit's - only one side of pads' copper is exposed. PTH-RIGHT-ANGLE-KIT - Right-angle, through-hole Right Angle Tactile Button <https://www.sparkfun.com/products/10791> - Used on SparkFun BigTime Watch Kit <https://www.sparkfun.com/products/11734> SMD-12MM - 12mm square, surface-mount Tactile Button - SMD (12mm) <https://www.sparkfun.com/products/12993> (COM-12993) Used on SparkFun PicoBoard <https://www.sparkfun.com/products/11888> SMD-4.5MM - 4.5mm Square Trackball Switch Used on SparkFun Blackberry Trackballer Breakout <https://www.sparkfun.com/products/13169> SMD-4.6MMX2.8MM - 4.60mm x 2.80mm, surface mount Used on SparkFun SAMD21 Mini Breakout <https://www.sparkfun.com/products/13664> SMD-5.2MM, SMD-5.2-REDUNDANT - 5.2mm square, surface-mount Mini Pushbutton Switch - SMD <https://www.sparkfun.com/products/8720> (COM-08720) Used on Arduino Pro Mini <https://www.sparkfun.com/products/11114> REDUNDANT package connects both switch circuits together SMD-6.0X3.5MM - 6.0 x 3.5mm, surface mount Momentary Reset Switch SMD <https://www.sparkfun.com/products/8229> (COM-08229) SMD-6.2MM-TALL - 6.2mm square, surface mount Tactile Button - SMD (6mm) <https://www.sparkfun.com/products/12992> Used on SparkFun Digital Sandbox <https://www.sparkfun.com/products/12651> SMD-RIGHT-ANGLE - Right-angle, surface mount Used on SparkFun Block for Intel® Edison - Arduino <https://www.sparkfun.com/products/13036>; PROD_ID: SWCH-08247; SF_SKU: COM-08720
S4 = SparkFun-Switches:SWITCH-SPDT: Single Pole, Double Throw (SPDT) Switch Single-pole, double-throw (SPDT) switch. Variant Overview SMD-AYZ0202 Surface Mount DPDT Switch <https://www.sparkfun.com/products/597> (COM-00597) Used on e.g. LilyPad Arduino USB - ATmega32U4 Board <https://www.sparkfun.com/products/12049> PTH-11.6X4.0MM SPDT Mini Power Switch <https://www.sparkfun.com/products/102> (COM-00102) Used on e.g. SparkFun Simon Says - Through-Hole Soldering Kit <https://www.sparkfun.com/products/10547> (KIT-10547) PTH-11.6X4.0MM-KIT KIT version of SPDT Mini Power Switch - Simplifies soldering by removing tStop of switch pins - only one side can be soldered. PTH-11.6X4.0MM-LOCK LOCK version of SPDT Mini Power Switch - Offset pins hold switch in place for easier soldering. SMD-RIGHT-ANGLE Surface Mount Right Angle Switch <https://www.sparkfun.com/products/10860> (COM-10860) Used on e.g. SparkFun ESP8266 Thing <https://www.sparkfun.com/products/13231>; PROD_ID: SWCH-08261; SF_SKU: COM-00102
U1 = ICE40HX1K-VQ100:ICE40HX1K-VQ100: HX Series 1280 LUTs 95 I/O 64 kBit RAM 1.2 V Surface Mount FPGA - VQFP-100; AVAILABILITY: Unavailable; DESCRIPTION: HX Series 1280 LUTs 95 I/O 64 kBit RAM 1.2 V Surface Mount FPGA - VQFP-100; MF: Lattice Semiconductor; MP: ICE40HX1K-VQ100; PACKAGE: TQFP-100 Lattice Semiconductor; PRICE: None
U2 = SparkFun-IC-Microcontroller:CY7C65213: CY7C65213 USB-UART controller USB UART SparkFun Products None; PROD_ID: IC-12487
U3 = SparkFun-IC-Memory:W25Q32FV: W25Q32FV 32Mb (4MB) Serial Flash Memory The W25Q32FV support the standard Serial Peripheral Interface (SPI), Dual/Quad I/O SPI as well as 2-clocks instruction cycle Quad Peripheral Interface (QPI). 104MHz, SPI, 8-SOIC-EIAJ Datasheet <http://www.winbond.com/resource-files/w25q32fv%20revh%20091613.pdf> SparkFun Products SparkFun Blynk Board - ESP8266 <https://www.sparkfun.com/products/13794> (WRL-13794); PROD_ID: IC-13229
U4 = SparkFun-IC-Microcontroller:ATMEGA328P_TQFP: Popular 328P in QFP Storefront component: ATmega328 - TQFP <https://www.sparkfun.com/products/13448> (COM-13448) Datasheet <http://www.sparkfun.com/datasheets/Components/SMD/ATMega328.pdf> SparkFun Products SparkFun RedBoard - Programmed with Arduino <https://www.sparkfun.com/products/12757> (DEV-12757) Arduino Pro Mini 328 - 5V/16MHz <https://www.sparkfun.com/products/11113> (DEV-11113) Arduino Pro Mini 328 - 3.3V/8MHz <https://www.sparkfun.com/products/11114> (DEV-11114) SparkFun OpenLog <https://www.sparkfun.com/products/13712> (DEV-13712) SparkFun MicroView - OLED Arduino Module <https://www.sparkfun.com/products/12923> (DEV-12923) SparkFun Digital Sandbox <https://www.sparkfun.com/products/12651> (DEV-12651) SparkFun PicoBoard <https://www.sparkfun.com/products/11888> (WIG-11888) Arduino Fio <https://www.sparkfun.com/products/10116> (DEV-10116) LilyPad Arduino 328 Main Board <https://www.sparkfun.com/products/13342> (DEV-13342) SparkFun RedStick <https://www.sparkfun.com/products/13741> (DEV-13741) LilyPad MP3 <https://www.sparkfun.com/products/11013> (DEV-11013) LilyPad Arduino SimpleSnap <https://www.sparkfun.com/products/10941> (DEV-10941) SparkFun Stepoko <https://www.sparkfun.com/products/13899> (ROB-13899) SparkFun Geiger Counter <https://www.sparkfun.com/products/11345> (SEN-11345) SparkFun EL Sequencer <https://www.sparkfun.com/products/12781> (COM-12781) Arduino Pro 328 - 5V/16MHz <https://www.sparkfun.com/products/10915> (DEV-10915) CryptoCape <https://www.sparkfun.com/products/12773> (DEV-12773) SparkFun IR Thermometer Evaluation Board - MLX90614 <https://www.sparkfun.com/products/10740> (SEN-10740) SparkFun RedBot Mainboard <https://www.sparkfun.com/products/12097> (ROB-12097) Arduino Pro 328 - 3.3V/8MHz <https://www.sparkfun.com/products/10914> (DEV-10914) SparkFun Block for Intel® Edison - Arduino <https://www.sparkfun.com/products/13036> (DEV-13036) SparkFun Simon Says - Surface Mount Soldering Kit <https://www.sparkfun.com/products/10935> (KIT-10935) SparkFun 7-Segment Serial Display - Red <https://www.sparkfun.com/products/11441> (COM-11441) SparkFun 7-Segment Serial Display - White <https://www.sparkfun.com/products/11629> (COM-11629) SparkFun 7-Segment Serial Display - Yellow <https://www.sparkfun.com/products/11443> (COM-11443) SparkFun 7-Segment Serial Display - Kelly Green <https://www.sparkfun.com/products/11440> (COM-11440) SparkFun 7-Segment Serial Display - Blue <https://www.sparkfun.com/products/11442> (COM-11442) SparkFun OpenSegment Serial Display - 20mm (Blue) <https://www.sparkfun.com/products/11647> (COM-11647) SparkFun OpenSegment Serial Display - 20mm (Green) <https://www.sparkfun.com/products/11646> (COM-11646) SparkFun OpenSegment Serial Display - 20mm (White) <https://www.sparkfun.com/products/11648> (COM-11648) SparkFun OpenSegment Serial Display - 20mm (Red) <https://www.sparkfun.com/products/11644> (COM-11644) SparkFun OpenSegment Serial Display - 20mm (Yellow) <https://www.sparkfun.com/products/11645> (COM-11645) SparkFun OpenSegment Shield <https://www.sparkfun.com/products/13190> (DEV-13190); PROD_ID: IC-09069
U7 U9 = SparkFun-IC-Power:V_REG_317: Voltage Regulator Standard LM317 adjustable voltage regulator. AOI (Adjust Output Input). Google 'LM317 Calculator' for easy to use app to get the two resistor values needed. 240/720 for 5V output. 240/390 for 3.3V output. Spark Fun Electronics SKU : COM-00527
U$2 = SOT95P280X145-5N:TPS613221A
Y1 = SmartPrj:RESONATOR
Y2 = SparkFun-Clocks:OSCILLATOR: Oscillators (Generic) These are active oscillators, which require a power source to generate their clock output. Most oscillators are configured to generate a set frequency (e.g. 16MHz). They have four pins: power, ground, output, and an enable input.

## Net classes
2 gnd: width 0.305 mm, drill 0.559 mm, clearance 0.254 mm

## Board
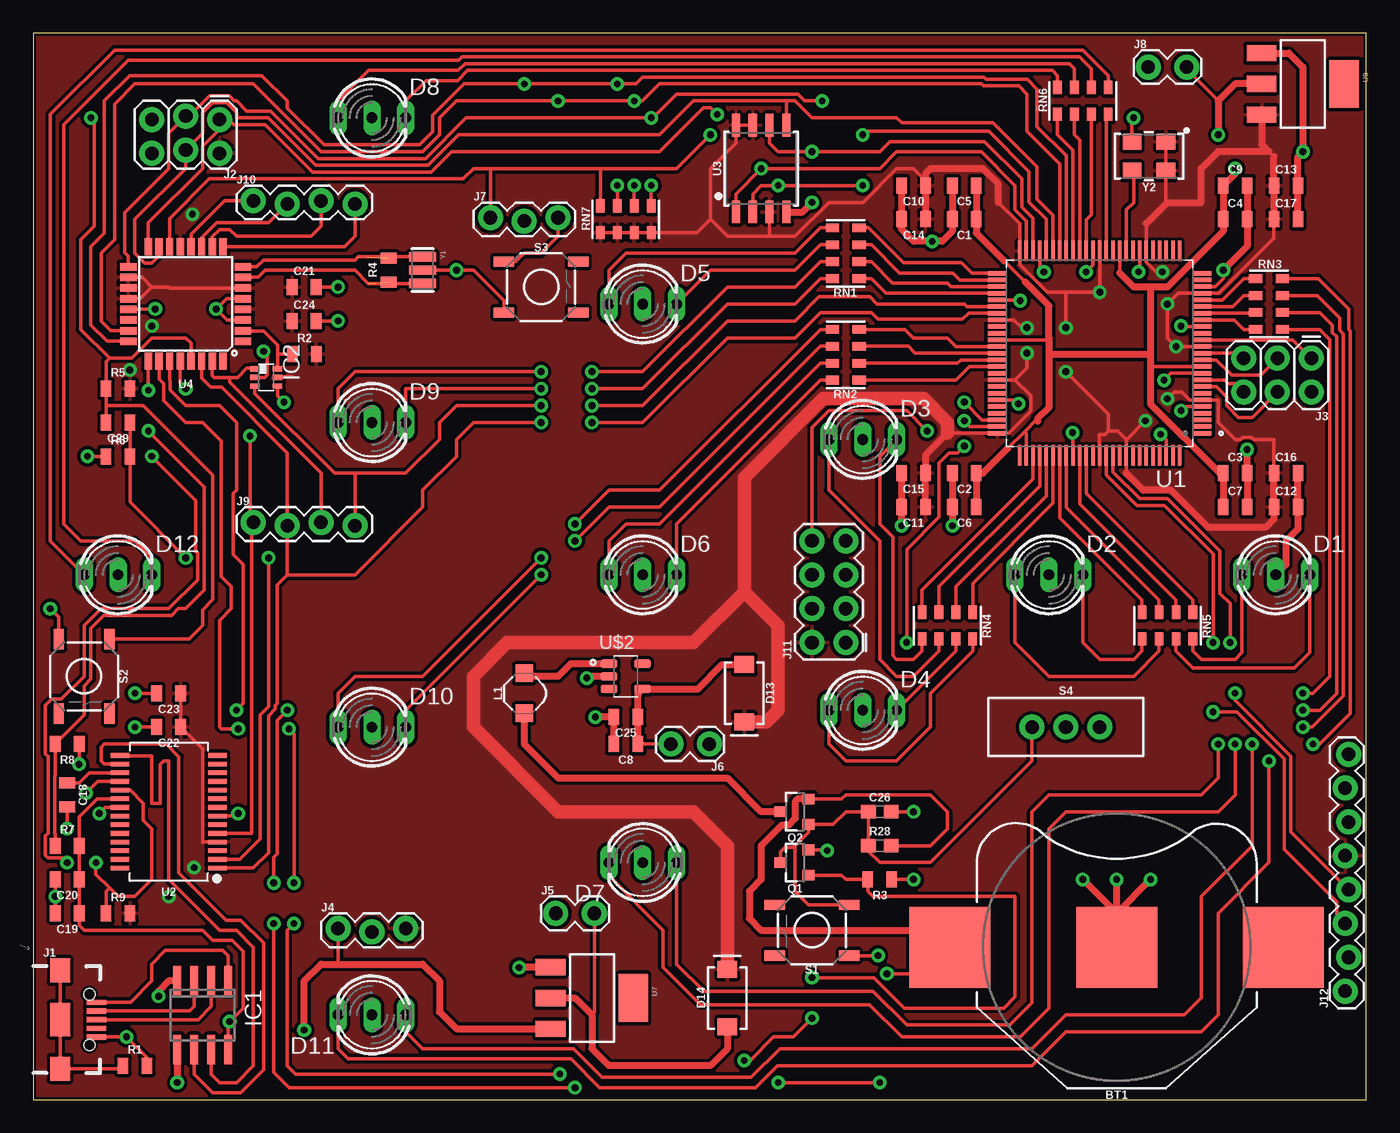
[diagram p1: board, top side]
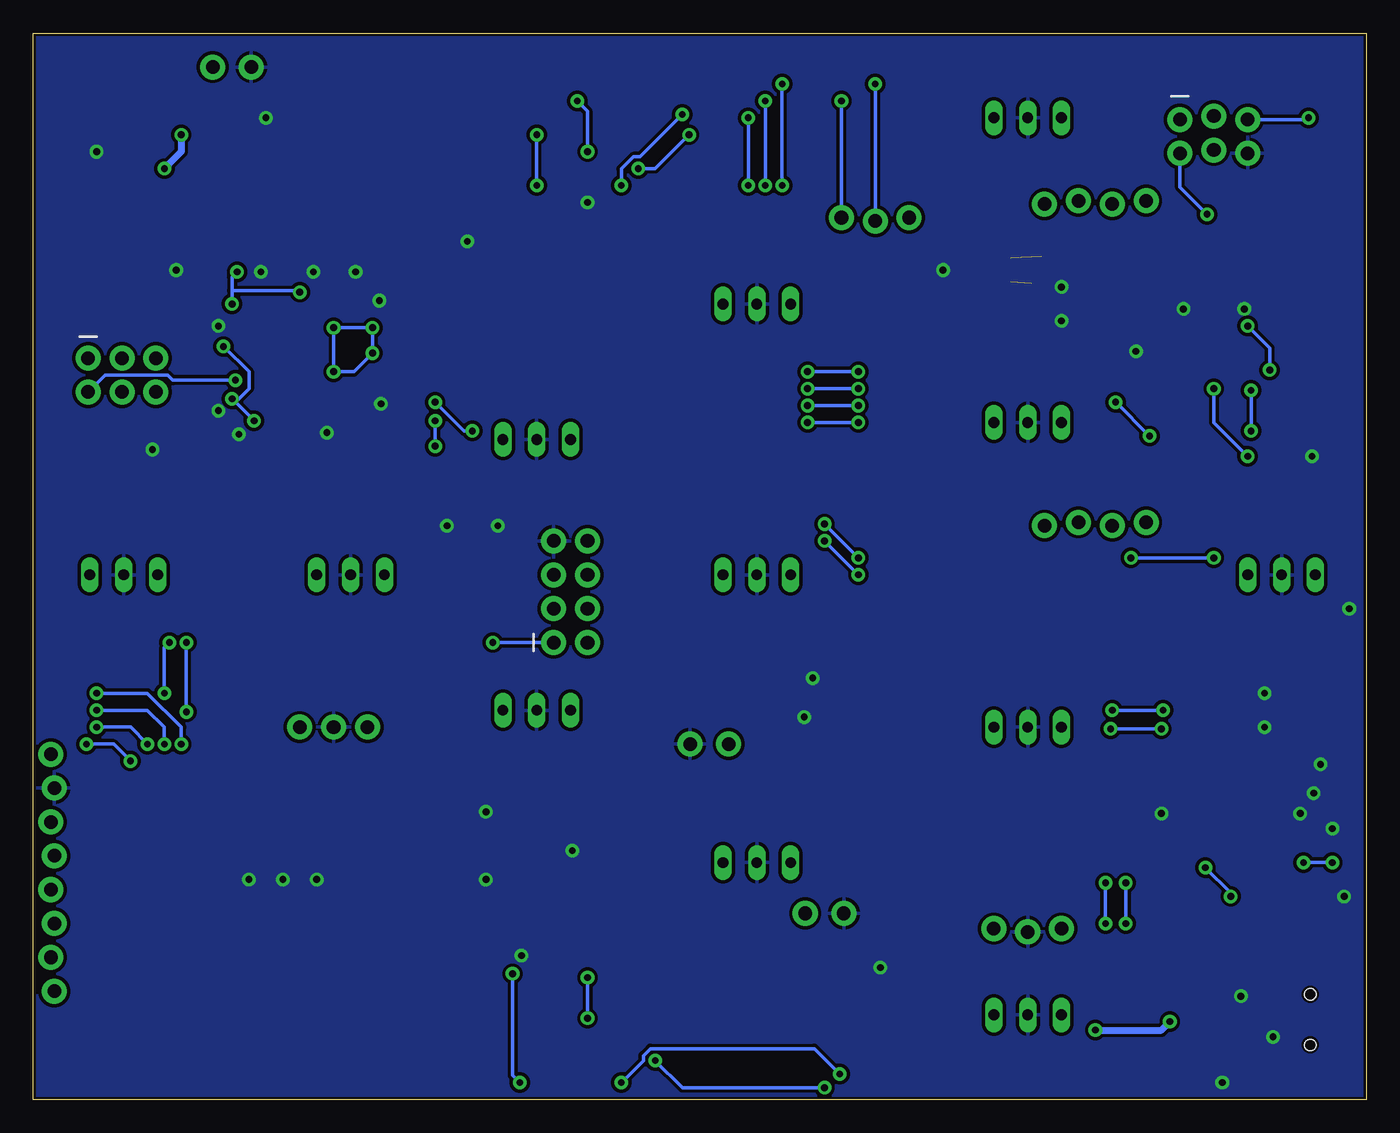
[diagram p2: board, bottom side, seen from below]

Size 100 x 80 mm. Coordinates in mm from the lower left corner, seen from the top.
Outline: 0,0 100,0 100,80 0,80 0,0
Copper layers (1*16): Top 0.035mm / dielectric 1.5mm / Bottom 0.035mm
Design rules "SparkFun-2-layer-STANDARD": minimum track width 10mil, minimum drill 20mil, track to track 10mil, track to pad 8mil, pad to pad 8mil, via to via 10mil, smd to smd 8mil, copper to edge 8mil, drill to drill 8mil, minimum pad ring 10mil, minimum via ring 10mil, stop-mask expansion 4mil, vias tented up to drill 25mil, thermal gap 10mil

### Footprints (pad centres in the part's own frame; a part is rotated, then mirrored left to right if it is on the bottom)
BATTCON_20MM = smd 6.07 x 6.07: 1 -12.5,0; 2 0,0; 3 12.5,0
0805 = smd 0.8 x 1.2: 1 -0.9,0; 2 0.9,0
0603 = smd 1.1 x 1: 1 -0.85,0; 2 0.85,0
DUOLED5MM = drill 0.813 long: AG -2.54,0; AR 2.54,0; K 0,0
SMA-DIODE = smd 1.27 x 1.47: A -2.15,0; C 2.15,0
SO08 = smd 0.6 x 2.2: 1 -1.905,-2.6; 2 -0.635,-2.6; 3 0.635,-2.6; 4 1.905,-2.6; 5 1.905,2.6; 6 0.635,2.6; 7 -0.635,2.6; 8 -1.905,2.6
DCK_R-PDSO-G6 = smd 0.4 x 0.7: 1 -0.65,-0.85; 2 0,-0.85; 3 0.65,-0.85; 4 0.65,0.85; 5 0,0.85; 6 -0.65,0.85
USB-B-MICRO-SMD = smd 1.45 x 0.4: D+ 2.725,0; D- 2.725,0.65; GND 2.725,-1.3; ID 2.725,-0.65; VBUS 2.725,1.3 | smd 1.5 x 1.8: SHIELD1 0,3.685; SHIELD2 0,-3.685 | smd 1.5 x 2.5: SHIELD3 0,0 | hole 0.85: 2.2,1.9; 2.2,-1.9
2X3_LOCK = drill 1.016 pad 1.88: 1 0,0.127; 2 0,2.667; 3 2.54,-0.127; 4 2.54,2.413; 5 5.08,0.127; 6 5.08,2.667
2X3 = drill 1.016 pad 1.88: 1 0,0; 2 0,2.54; 3 2.54,0; 4 2.54,2.54; 5 5.08,0; 6 5.08,2.54
1X03_LOCK = drill 1.016 pad 1.88: 1 0,0.127; 2 2.54,-0.127; 3 5.08,0.127
1X02_LOCK = drill 1.016 pad 1.88: 1 -0.178,0; 2 2.718,0
1X04_LOCK = drill 1.016 pad 1.88: 1 0,0.127; 2 2.54,-0.127; 3 5.08,0.127; 4 7.62,-0.127
2X4 = drill 1.016 pad 1.88: 1 -3.81,-1.27; 2 -3.81,1.27; 3 -1.27,-1.27; 4 -1.27,1.27; 5 1.27,-1.27; 6 1.27,1.27; 7 3.81,-1.27; 8 3.81,1.27
1X08_LOCK = drill 1.016 pad 1.88: 1 0,0.127; 2 2.54,-0.127; 3 5.08,0.127; 4 7.62,-0.127; 5 10.16,0.127; 6 12.7,-0.127; 7 15.24,0.127; 8 17.78,-0.127
INDUCTOR_4.7UH = smd 1.3 x 1.3: P$1 -1.5,0; P$2 1.5,0
SOT23-3 = smd 0.8 x 0.9: 1 -0.95,-1; 2 0.95,-1; 3 0,1.1
0805-ARV = smd 0.65 x 1: 1 -1.905,-1; 2 -0.635,-1; 3 0.635,-1; 4 1.905,-1; 5 1.905,1; 6 0.635,1; 7 -0.635,1; 8 -1.905,1
TACTILE_SWITCH_SMD_5.2MM = smd 1.524 x 0.762: 1 -2.794,1.905; 2 2.794,1.905; 3 -2.794,-1.905; 4 2.794,-1.905
SWITCH_SPDT_PTH_11.6X4.0MM = drill 1.016 pad 1.88: 1 0,2.54; 2 0,0; 3 0,-2.54
QFP50P1600X1600X120-100N = smd 1.47 x 0.28: 1 -7.67,6; 2 -7.67,5.5; 3 -7.67,5; 4 -7.67,4.5; 5 -7.67,4; 6 -7.67,3.5; 7 -7.67,3; 8 -7.67,2.5; 9 -7.67,2; 10 -7.67,1.5; 11 -7.67,1; 12 -7.67,0.5; 13 -7.67,0; 14 -7.67,-0.5; 15 -7.67,-1; 16 -7.67,-1.5; 17 -7.67,-2; 18 -7.67,-2.5; 19 -7.67,-3; 20 -7.67,-3.5; 21 -7.67,-4; 22 -7.67,-4.5; 23 -7.67,-5; 24 -7.67,-5.5; 25 -7.67,-6; 51 7.67,-6; 52 7.67,-5.5; 53 7.67,-5; 54 7.67,-4.5; 55 7.67,-4; 56 7.67,-3.5; 57 7.67,-3; 58 7.67,-2.5; 59 7.67,-2; 60 7.67,-1.5; 61 7.67,-1; 62 7.67,-0.5; 63 7.67,0; 64 7.67,0.5; 65 7.67,1; 66 7.67,1.5; 67 7.67,2; 68 7.67,2.5; 69 7.67,3; 70 7.67,3.5; 71 7.67,4; 72 7.67,4.5; 73 7.67,5; 74 7.67,5.5; 75 7.67,6 | smd 0.28 x 1.47: 26 -6,-7.67; 27 -5.5,-7.67; 28 -5,-7.67; 29 -4.5,-7.67; 30 -4,-7.67; 31 -3.5,-7.67; 32 -3,-7.67; 33 -2.5,-7.67; 34 -2,-7.67; 35 -1.5,-7.67; 36 -1,-7.67; 37 -0.5,-7.67; 38 0,-7.67; 39 0.5,-7.67; 40 1,-7.67; 41 1.5,-7.67; 42 2,-7.67; 43 2.5,-7.67; 44 3,-7.67; 45 3.5,-7.67; 46 4,-7.67; 47 4.5,-7.67; 48 5,-7.67; 49 5.5,-7.67; 50 6,-7.67; 76 6,7.67; 77 5.5,7.67; 78 5,7.67; 79 4.5,7.67; 80 4,7.67; 81 3.5,7.67; 82 3,7.67; 83 2.5,7.67; 84 2,7.67; 85 1.5,7.67; 86 1,7.67; 87 0.5,7.67; 88 0,7.67; 89 -0.5,7.67; 90 -1,7.67; 91 -1.5,7.67; 92 -2,7.67; 93 -2.5,7.67; 94 -3,7.67; 95 -3.5,7.67; 96 -4,7.67; 97 -4.5,7.67; 98 -5,7.67; 99 -5.5,7.67; 100 -6,7.67
SSOP28DB = smd 0.348 x 1.397: 1 -4.225,-3.656; 2 -3.575,-3.656; 3 -2.925,-3.656; 4 -2.275,-3.656; 5 -1.625,-3.656; 6 -0.975,-3.656; 7 -0.325,-3.656; 8 0.325,-3.656; 9 0.975,-3.656; 10 1.625,-3.656; 11 2.275,-3.656; 12 2.925,-3.656; 13 3.575,-3.656; 14 4.225,-3.656; 15 4.225,3.656; 16 3.575,3.656; 17 2.925,3.656; 18 2.275,3.656; 19 1.625,3.656; 20 0.975,3.656; 21 0.325,3.656; 22 -0.325,3.656; 23 -0.975,3.656; 24 -1.625,3.656; 25 -2.275,3.656; 26 -2.925,3.656; 27 -3.575,3.656; 28 -4.225,3.656
SOIC-8 = smd 0.61 x 1.702: 1 -1.905,-3.251; 2 -0.635,-3.251; 3 0.635,-3.251; 4 1.905,-3.251; 5 1.905,3.251; 6 0.635,3.251; 7 -0.635,3.251; 8 -1.905,3.251
TQFP32-08 = smd 1.27 x 0.559: 1 -4.293,2.8; 2 -4.293,2; 3 -4.293,1.2; 4 -4.293,0.4; 5 -4.293,-0.4; 6 -4.293,-1.2; 7 -4.293,-2; 8 -4.293,-2.8; 17 4.293,-2.8; 18 4.293,-2; 19 4.293,-1.2; 20 4.293,-0.4; 21 4.293,0.4; 22 4.293,1.2; 23 4.293,2; 24 4.293,2.8 | smd 0.559 x 1.27: 9 -2.8,-4.293; 10 -2,-4.293; 11 -1.2,-4.293; 12 -0.4,-4.293; 13 0.4,-4.293; 14 1.2,-4.293; 15 2,-4.293; 16 2.8,-4.293; 25 2.8,4.293; 26 2,4.293; 27 1.2,4.293; 28 0.4,4.293; 29 -0.4,4.293; 30 -1.2,4.293; 31 -2,4.293; 32 -2.8,4.293
SOT223 = smd 1.219 x 2.235: 1 -2.311,-3.099; 2 0,-3.099; 3 2.311,-3.099 | smd 3.6 x 2.2: 4 0,3.099
SOT95P280X145-5N = smd 1.27 x 0.635: 1 -1.255,0.95; 2 -1.255,0; 3 -1.255,-0.95; 4 1.255,-0.95; 5 1.255,0.95
RESONATOR = smd 0.7 x 2: 1 -1,0; 2 0,0; 3 1,0
OSCILLATOR-SMD-5X3.2 = smd 1.397 x 1.194: 1 -1.27,-1.1; 2 1.27,-1.1; 3 1.27,1.1; 4 -1.27,1.1

### Placement (x,y rotation side)
BT1  81.28,11.43 0 top
C1  69.85,66.04 180 top
C2  69.85,46.99 180 top
C3  90.17,46.99 0 top
C4  90.17,66.04 0 top
C5  69.85,68.58 180 top
C6  69.85,44.45 180 top
C7  90.17,44.45 0 top
C8  44.45,26.67 180 top
C9  90.17,68.58 0 top
C10  66.04,68.58 180 top
C11  66.04,44.45 180 top
C12  93.98,44.45 0 top
C13  93.98,68.58 0 top
C14  66.04,66.04 180 top
C15  66.04,46.99 180 top
C16  93.98,46.99 0 top
C17  93.98,66.04 0 top
C18  2.54,22.86 270 top
C19  2.54,13.97 180 top
C20  2.54,16.51 180 top
C21  20.32,60.96 0 top
C22  10.16,27.94 180 top
C23  10.16,30.48 180 top
C24  20.32,58.42 0 top
C25  44.45,28.7 180 top
C26  63.5,21.59 0 top
C29  6.35,50.8 180 top
D1  93.22,39.37 0 top
D2  76.2,39.37 0 top
D3  62.23,49.53 0 top
D4  62.23,29.21 0 top
D5  45.72,59.69 0 top
D6  45.72,39.37 0 top
D7  45.72,17.78 180 top
D8  25.4,73.66 0 top
D9  25.4,50.8 0 top
D10  25.4,27.94 0 top
D11  25.4,6.35 180 top
D12  6.35,39.37 0 top
D13  53.34,30.48 270 top
D14  52.07,7.62 90 top
IC1  12.7,6.35 180 top
IC2  17.47,54.18 270 top
J1  2,6 0 top
J2  13.97,73.66 180 top
J3  95.89,55.63 180 top
J4  22.86,12.7 0 top
J5  39.37,13.97 0 top
J6  50.55,26.67 180 top
J7  34.29,66.04 0 top
J8  83.82,77.47 0 top
J9  16.51,43.18 0 top
J10  16.51,67.31 0 top
J11  59.69,38.1 90 top
J12  98.55,8.13 90 top
L1  36.83,30.48 90 top
Q1  57.15,17.78 90 top
Q2  57.15,21.59 90 top
R1  7.62,2.54 0 top
R2  20.34,55.93 0 top
R3  63.5,16.51 180 top
R4  26.67,62.23 90 top
R5  6.35,53.34 0 top
R6  6.35,48.26 0 top
R7  2.54,19.05 0 top
R8  2.54,26.67 180 top
R9  6.35,13.97 0 top
R28  63.5,19.05 0 top
RN1  60.96,63.5 90 top
RN2  60.96,55.88 90 top
RN3  92.71,59.69 270 top
RN4  68.58,35.56 180 top
RN5  85.09,35.56 180 top
RN6  78.74,74.93 0 top
RN7  44.45,66.04 0 top
S1  58.42,12.7 180 top
S2  3.81,31.75 270 top
S3  38.1,60.96 0 top
S4  77.47,27.94 270 top
U1  80,56 180 top
U2  10.16,21.59 90 top
U3  54.61,69.85 0 top
U4  11.43,59.69 180 top
U7  41.91,7.62 270 top
U9  95.25,76.2 270 top
U$2  44.45,31.75 0 top
Y1  29.21,62.23 270 top
Y2  83.7,70.78 180 top

### Tracks (layer width: path | path; a pad name or v marks a point on that pad's centre or on a via)
AVR_IO_1
  Top 0.254: U4.9 23.34,63.98 24.13,64.77 J10.4
AVR_IO_2
  Top 0.254: U4.10 13.43,64.74 13.97,65.28 14.73,65.28 15.24,64.77 20.83,64.77 21.59,65.53 J10.3
AVR_IO_3
  Top 0.254: U4.11 12.63,64.66 13.76,65.79 17.65,65.79 J10.2
AVR_IO_4
  Top 0.254: U4.12 11.83,64.92 14.35,67.44 J10.1
AVR_RST  (via drill 0.51)
  Top 0.254: 5.71,55.63 3.56,57.78 3.56,64.52 4.57,65.53 4.57,73.41 v4.32,73.66 | U4.29 11.83,56.75 11.43,57.15 8.89,57.15 7.37,55.63 5.71,55.63 | C29.2 5.45,52.07 | 5.45,52.07 R5.1 5.45,55.36 5.71,55.63 | S2.1 11.68,34.54 12.7,35.56 12.7,36.75 13.46,37.51 13.46,46.86 8.26,52.07 5.45,52.07
  Bottom 0.254: v4.32,73.66 4.45,73.53 J2.5
BLE_RXI  (via drill 0.51)
  Top 0.254: v89.79,34.29 89.79,37.21 89.03,37.97 89.03,41.14 85.08,45.09 83.01,45.09 81,47.09 U1.90 | J12.4 94.36,20.07 94.36,25.75 90.17,29.94 v90.17,30.48
  Bottom 0.254: v90.17,30.48 90.17,33.91 v89.79,34.29
BLE_TXO  (via drill 0.51)
  Top 0.254: J12.3 97.79,13.84 97.79,14.84 93.85,18.78 93.85,25.54 90.31,29.08 v88.52,29.08 | v88.52,34.29 88.52,40.93 84.87,44.58 82.8,44.58 80.5,46.87 U1.89
  Bottom 0.254: v88.52,29.08 v88.52,34.29
CDONE  (via drill 0.51)
  Top 0.254: U1.43 77.5,70.82 75.31,73 75.31,75.82 74.57,76.56 71.48,76.56 71.33,76.71 45.72,76.71 45.21,76.2 v43.81,76.2 v36.83,76.2 32.3,76.2 29.97,73.87 29.97,72.6 29,71.63 21.8,71.63 19.05,74.38 19.05,74.93 17.14,76.83 7.24,76.83 5.33,74.93 5.33,65.02 4.32,64.01 4.32,60.96 4.32,59.69 4.32,58.12 5.55,56.89 U4.24 | RN7.7 v43.81,68.58
  Bottom 0.254: v43.81,68.58 v43.81,76.2 | J7.2 v36.83,76.2
CLK
  Top 0.254: U1.34 82,66.76 82.55,67.31 82.55,69.56 Y2.3
CRESET_B  (via drill 0.51)
  Top 0.254: U1.44 77,70.19 74.55,72.64 74.55,75.44 73.94,76.05 71.27,76.05 71.12,76.2 46.99,76.2 45.72,74.93 v45.09,74.93 v39.37,74.93 31.75,74.93 30.48,73.66 30.48,72.39 29.21,71.12 21.59,71.12 16.51,76.2 7.62,76.2 6.1,74.68 6.1,64.52 5.08,63.5 5.08,58.42 5.81,57.69 U4.23 | RN7.6 v45.09,68.58 | S3.1 36.2,62.87 36.83,63.5 38.1,63.5 39.37,64.77 J7.3
  Bottom 0.254: v45.09,68.58 v45.09,74.93 | J7.3 v39.37,74.93
CS#  (via drill 0.51)
  Top 0.254: U3.1 52.7,67.94 v54.61,69.85 63.5,69.85 64.77,71.12 71.12,71.12 73.66,68.58 73.66,66.76 74.5,65.92 U1.49 | U4.14 10.23,64.14 | 34.29,69.85 33.02,69.85 32.26,69.09 13.21,69.09 10.23,66.11 U4.14 | 34.29,69.85 42.55,69.85 | 42.55,69.85 48.26,69.85 v50.8,72.39 | RN7.8 42.55,69.85 | 10.23,63.5 U4.14 | J7.1 34.29,69.85
  Bottom 0.254: v50.8,72.39 53.34,69.85 v54.61,69.85
DMINUS
  Top 0.254: IC1.6 12.06,1.91 13.46,0.51 15.56,0.51 17.27,2.22 17.27,11.75 15.56,13.46 14.48,13.46 10.92,17.02 10.92,25.72 9.97,26.67 5.33,26.67 5.08,26.42 5.08,25.4 5.32,25.16 U2.16
DPLUS
  Top 0.254: IC1.7 13.34,1.91 13.97,1.27 15.24,1.27 16.51,2.54 16.51,11.43 15.24,12.7 13.97,12.7 10.16,16.51 10.16,25.4 9.78,25.4 9.53,25.15 9.53,22.23 8.89,22.23 8.89,25.78 6.54,25.78 U2.15
FPGA1
  Top 0.254: RN1.4 62.67,65.41 65.29,62.79 69.64,62.79 70.43,62 U1.51
FPGA2
  Top 0.254: U1.52 69.5,61.5 68.98,62.02 64.98,62.02 62.87,64.14 RN1.3
FPGA3
  Top 0.254: U1.53 68.84,61 68.58,61.26 64.47,61.26 62.87,62.87 RN1.2
FPGA4
  Top 0.254: U1.54 63.96,60.5 62.87,61.59 RN1.1
FPGA5
  Top 0.254: U1.62 69.23,56.5 68.58,57.15 66.04,57.15 65.41,57.78 RN2.4
FPGA6
  Top 0.254: U1.63 66.16,56 65.64,56.52 RN2.3
FPGA7
  Top 0.254: RN2.2 69.34,55.24 69.6,55.5 U1.64
FPGA8
  Top 0.254: U1.65 70.24,55 69.22,53.98 RN2.1
FPGA9
  Top 0.254: U1.18 90.09,58.5 90.81,57.78 RN3.4
FPGA10
  Top 0.254: U1.19 91.66,59 RN3.3
FPGA11
  Top 0.254: U1.20 89.98,59.5 90.81,60.33 RN3.2
FPGA12
  Top 0.254: U1.21 89.21,60 90.81,61.59 RN3.1
FPGA13
  Top 0.254: U1.78 75,46.55 66.67,38.23 RN4.4
FPGA14
  Top 0.254: U1.79 75.5,46.04 67.94,38.48 RN4.3
FPGA15
  Top 0.254: U1.80 76,45.27 69.22,38.48 RN4.2
FPGA16
  Top 0.254: U1.81 76.5,44.75 70.48,38.73 RN4.1
FPGA17
  Top 0.254: U1.82 77,43.65 83.19,37.47 RN5.4
FPGA18
  Top 0.254: U1.83 77.5,44.42 84.45,37.47 RN5.3
FPGA19
  Top 0.254: U1.85 78.5,44.69 85.72,37.47 RN5.2
FPGA20
  Top 0.254: U1.86 79,45.46 87,37.47 RN5.1
FPGA21
  Top 0.254: RN6.4 80.5,73.78 U1.37
FPGA22
  Top 0.254: RN6.3 79.38,66.4 79,66.02 U1.40
FPGA23
  Top 0.254: RN6.2 78.11,72.39 78.51,71.99 78.5,71.98 U1.41
FPGA24
  Top 0.254: U1.42 78,71.22 76.83,72.39 RN6.1
GND  (via drill 0.51)
  Top 0.254: U1.32 83,62.17 v82.93,62.1 | U1.39 79.5,62.61 v78.99,62.1 | U1.47 75.5,62.42 v75.82,62.1 | U1.55 73.98,60 v74.04,59.94 | U1.70 73.61,52.5 v73.91,52.2 | U1.84 78,50.02 v77.98,50.04 | U1.98 85,49.49 v84.58,49.91 | U1.5 86.42,52 v86.11,51.69 | U1.17 86.14,58 v86.11,58.04 | U1.23 88.69,61 89.28,61.59 v89.28,62.23 | J1.GND v6.98,4.7 v6.99,4.7 8.52,3.16 R1.2 | C20.2 v1.64,15.25 | v1.64,15.25 v1.65,15.24 | C19.2 v1.64,15.25 | C18.2 v2.54,20.32 | U4.21 9.12,59.29 v9.14,59.31 | U4.3 14.54,58.49 v13.72,59.31 14.5,60.09 U4.5 | Y2.2 82.43,73.54 v82.55,73.66 | C23.2 v7.62,30.48 | C22.2 v7.62,27.94 | v22.86,60.96 C21.2 | v22.86,58.42 C24.2 | U2.21 5.41,21.91 v4.95,21.46 | U2.7 15.17,21.27 v15.37,21.46 | U2.18 4.82,23.86 v3.94,22.99 | IC2.2 17.35,54.18 17.53,54.36 17.53,55.88 v17.27,56.13 | R3.1 v66.04,16.51 | S1.1 v63.37,10.79 | C26.2 v66.04,21.59 | Q1.2 59.5,18.73 v59.56,18.67 | R6.1 v4.06,48.26 | S2.3 1.91,36.2 v1.27,36.83 | Y1.2 v31.75,62.23 33.02,62.23 35.31,59.94 S3.3 | R8.1 v3.44,25.16 v3.43,25.15
  Top 0.508: C9.2 C4.2 91.07,64.02 v89.28,62.23 | C17.2 C13.2 94.88,70.75 v95.25,71.12 95.25,77.47 94.21,78.51 U9.1 | C2.2 C6.2 68.95,43.06 v68.96,43.05 | C15.2 C11.2 65.14,43.06 v65.15,43.05 | C5.2 C1.2 68.95,65.14 68.2,64.39 v67.44,64.39 66.04,64.39 65.14,65.29 C14.2 C10.2 | U3.4 57.71,66.6 v58.42,67.31 | U$2.2 41.66,31.75 v41.53,31.62 | U7.1 36.47,9.93 v36.45,9.91 | IC1.4 10.73,8.89 10.16,8.89 9.4,8.13 v9.4,7.75 | IC1.5 v10.79,1.27 | C7.2 C3.2 91.07,48.76 v91.06,48.77 | C16.2 C12.2 94.88,42.81 93.98,41.91 93.98,40.13 D1.K | C8.2 C25.2 v42.16,28.7 | v81.28,16.51 BT1.2 81.28,13.97 | 81.28,13.97 v78.74,16.51 | 81.28,13.97 v83.82,16.51
  pour Bottom: 0,80.01 0,0 100.33,0 100.33,80.01
  pour Bottom (isolate 0.305): 0,0 0,80.01 100.33,80.01 100.33,0
HDR1
  Top 0.254: U1.15 94.51,57 J3.1
HDR2  (via drill 0.51)
  Top 0.254: U1.10 85.36,54.5 v84.84,53.98
  Bottom 0.254: v84.84,53.98 89.53,53.98 89.92,54.36 94.61,54.36 J3.2
HDR3
  Top 0.254: U1.12 88.77,55.5 89.92,54.36 92.08,54.36 J3.3
HDR4
  Top 0.254: J3.4 91.44,51.18 90.42,51.18 89.53,52.07 89.53,52.7 88.74,53.5 U1.8
HDR5
  Top 0.254: U1.13 90.43,56 J3.5
HDR6
  Top 0.254: J3.6 90.17,53.72 89.66,53.72 89.38,54 U1.9
LED1
  Top 0.254: D5.AG 43.18,62.23 44.45,63.5 57.15,63.5 59.05,65.41 RN1.5
LED2
  Top 0.254: RN1.6 59.05,64.14 57.15,62.23 50.8,62.23 D5.AR
LED3  (via drill 0.51)
  Top 0.254: D9.AG 22.86,53.34 24.13,54.61 v38.1,54.61 | v41.91,54.61 45.72,54.61 52.07,60.96 57.15,60.96 59.05,62.87 RN1.7
  Bottom 0.254: v38.1,54.61 v41.91,54.61
LED4  (via drill 0.51)
  Top 0.254: D9.AR 27.94,53.34 v38.1,53.34 | v41.91,53.34 45.72,53.34 52.07,59.69 57.15,59.69 59.05,61.59 RN1.8
  Bottom 0.254: v38.1,53.34 v41.91,53.34
LED5  (via drill 0.51)
  Top 0.254: v40.64,43.18 43.18,45.72 46.99,45.72 59.05,57.78 RN2.5 | v38.1,40.64 29.21,31.75 24.13,31.75 22.86,30.48 D10.AG
  Bottom 0.254: v38.1,40.64 v40.64,43.18
LED6  (via drill 0.51)
  Top 0.254: v40.64,41.91 43.18,44.45 46.99,44.45 59.05,56.52 RN2.6 | v38.1,39.37 27.94,29.21 D10.AR
  Bottom 0.254: v38.1,39.37 v40.64,41.91
LED7
  Top 0.254: D6.AG 43.18,41.91 44.45,43.18 46.99,43.18 59.05,55.24 RN2.7
LED8
  Top 0.254: RN2.8 59.05,53.98 48.26,43.18 D6.AR
LED9  (via drill 0.51)
  Top 0.254: RN3.5 96.52,57.78 97.28,57.02 97.28,31.75 96.01,30.48 v95.25,30.48 | D7.AG 48.26,10.16 50.3,8.12 63,8.12 65.53,5.59 73.28,5.59 74.93,7.24 74.93,21.59 76.2,22.86 87.63,22.86 88.9,24.13 v88.9,26.67
  Bottom 0.254: v88.9,26.67 88.9,27.94 91.44,30.48 v95.25,30.48
LED10  (via drill 0.51)
  Top 0.254: RN3.6 96.52,59.05 97.47,58.1 97.47,57.55 97.79,57.23 97.79,30.48 96.52,29.21 v95.25,29.21 | D7.AR 43.18,16.76 47.24,12.7 47.24,9.91 50.04,7.11 62.74,7.11 65.15,4.7 74.04,4.7 76.2,6.86 76.2,20.32 77.47,21.59 88.9,21.59 90.17,22.86 v90.17,26.67
  Bottom 0.254: v90.17,26.67 90.17,27.94 91.44,29.21 v95.25,29.21
LED11  (via drill 0.51)
  Top 0.254: RN3.7 96.33,60.33 98.01,58.64 98.01,57.73 98.3,57.44 98.3,30.27 95.97,27.94 v95.25,27.94 | v91.44,26.67 91.44,19.05 87.63,15.24 87.63,7.62 86.36,6.35 77.47,6.35 74.93,3.81 56.01,3.81 53.85,1.65 42.69,1.65 40.53,3.81 29.21,3.81 27.94,5.08 D11.AG
  Bottom 0.254: v91.44,26.67 92.71,27.94 v95.25,27.94
LED12  (via drill 0.51)
  Top 0.254: RN3.8 96.39,61.59 98.68,59.31 98.68,57.78 98.81,57.65 98.81,28.96 96.52,26.67 v96.01,26.67 | v92.71,25.4 92.71,17.78 88.9,13.97 88.9,6.35 87.63,5.08 77.47,5.08 74.93,2.54 55.81,2.54 54.16,0.89 42.5,0.89 40.34,3.05 23.62,3.05 22.86,3.81 D11.AR
  Bottom 0.254: v92.71,25.4 93.98,26.67 v96.01,26.67
LED13
  Top 0.254: RN4.5 66.67,33.66 66.04,33.02 64.77,33.02 64.49,33.3 64.49,42.19 63.5,43.18 63.5,48.26 D3.AR
LED14
  Top 0.254: RN4.6 67.94,33.66 66.04,31.75 64.77,31.75 63.5,33.02 63.5,41.91 59.69,45.72 D3.AG
LED15
  Top 0.254: D4.AR 69.22,33.66 RN4.7
LED16
  Top 0.254: RN4.8 70.48,33.66 67.31,30.48 67.31,27.94 64.77,25.4 60.96,25.4 59.69,26.67 D4.AG
LED17
  Top 0.254: D2.AR 78.74,34.29 80.01,33.02 82.55,33.02 83.19,33.66 RN5.5
LED18
  Top 0.254: RN5.6 84.45,33.66 82.55,31.75 76.2,31.75 73.66,34.29 D2.AG
LED19
  Top 0.254: RN5.7 85.72,33.66 87,32.38 94.61,32.38 95.76,33.53 D1.AR
LED20
  Top 0.254: RN5.8 87,33.66 87.63,33.02 90.17,33.02 90.68,33.53 D1.AG
LED21
  Top 0.254: RN6.5 80.64,76.83 78.74,78.74 6.1,78.74 1.27,73.91 1.27,41.91 D12.AG
LED22
  Top 0.254: RN6.6 79.38,77.34 78.49,78.23 32.18,78.23 31.92,77.98 7.11,77.98 2.29,73.15 2.29,43.18 3.56,41.91 7.62,41.91 8.89,40.64 D12.AR
LED23
  Top 0.254: D8.AG 22.86,74.93 25.15,77.22 31.88,77.22 32.39,77.72 77.72,77.72 78.11,77.34 RN6.7
LED24
  Top 0.254: D8.AR 27.94,74.93 29.46,76.45 31.84,76.45 32.6,77.22 76.45,77.22 76.83,76.83 RN6.8
MISO  (via drill 0.51)
  Top 0.254: U1.46 76,66.04 74.7,67.34 74.7,69.62 71.68,72.64 62.48,72.64 v62.23,72.39 | U4.16 8.63,65.78 12.7,69.85 12.7,71.52 13.97,72.79 J2.1 14.65,73.53 15.03,73.15 17.4,73.15 20.96,69.6 29.84,69.6 31.36,71.12 46.99,71.12 50.29,74.42 50.8,74.42 v51.31,73.91 | U3.2 53.98,67.94 54.61,68.58 v55.88,68.58 v62.23,68.58
  Bottom 0.254: v62.23,68.58 v62.23,72.39 | v51.31,73.91 54.48,70.74 54.98,70.74 55.88,69.84 v55.88,68.58
MOSI
  Top 0.254: U4.15 9.43,63.31 8.89,62.77 8.35,62.77 7.62,63.5 7.62,66.04 11.43,69.85 J2.4 12.7,72.52 12.7,74.06 13.44,74.8 14.5,74.8 15.24,74.06 15.24,73.66 17.61,73.66 21.17,70.1 29.63,70.1 31.92,72.39 46.99,72.39 49.53,74.93 56.52,74.93 | 56.52,74.93 57.15,74.93 58.42,73.66 64.77,73.66 65.15,73.28 72.01,73.28 75.31,69.98 75.31,67.56 76.5,66.38 U1.45 | U3.5 56.52,74.93
N$1  (via drill 0.51)
  Top 0.254: C29.1 R6.2 7.25,44.82 v11.43,40.64 | U2.2 15.47,18.02 17.02,19.56 17.02,28.87 17.65,29.5 v17.65,40.64
  Bottom 0.254: v17.65,40.64 v11.43,40.64
N$2
  Top 0.254: C8.1 J6.2
  Top 0.508: D13.A 51.68,32.63 49.85,30.8 U$2.4 45.35,30.45 C25.1 C8.1
N$3
  Top 0.254: C18.1 3.44,23.76 4.2,24.52 U2.17
N$4
  Top 0.254: R1.1 6.5,2.31 J1.SHIELD2 J1.SHIELD3 J1.SHIELD1
N$6
  Top 0.254: 57.15,19.05 57.15,15.62 58.17,14.61 S1.3 | 57.15,19.05 58.15,20.05 Q2.1 60.01,20.64 60.96,21.59 C26.1 R28.1 62.65,18.63 63.5,17.78 67.31,17.78 74.93,25.4 S4.3 | Q1.3 56.05,18.59 56.39,18.92 57.03,18.92 57.15,19.05
N$29
  Top 0.254: J5.2 42.09,6.53 41.91,6.35
  Top 0.508: D14.A 52.07,3.81 50.8,2.54 43.18,2.54 41.91,3.81 41.91,6.35 40.64,7.62 U7.2
N$30
  Top 0.254: J1.D+ 12.35,6 13.34,6.99 IC1.2
N$31
  Top 0.254: IC1.3 12.06,6.99 11.73,6.65 J1.D-
N$32
  Top 0.508: U$2.1 40.32,32.7 39.37,31.75 37.06,31.75 L1.P$2
N$33
  Top 0.254: IC1.1 14.61,10.79 14.22,11.18 9.91,11.18 8.89,10.16 8.89,8.89 7.3,7.3 J1.VBUS
PWR_CTRL  (via drill 0.51)
  Top 0.254: Q1.1 60.64,16.83 60.96,16.51 R3.2 62.6,15.63 62.99,15.24 73.66,15.24 73.66,7.7 72.81,6.86 65.36,6.86 63.08,9.13 v58.43,9.13 v58.42,9.14 | v58.42,6.1 57.02,4.7 55.54,4.7 53.77,2.92 v53.34,2.92 | v19.05,29.21 18.29,28.45 18.29,18.43 18.03,18.17 v18.03,16.26 | v18.03,13.21 18.03,2.03 19.18,0.89 v40.64,0.89 | v15.24,29.21 15.75,29.72 15.75,40.13 14.99,40.89 14.99,45.47 15.24,45.72 15.24,50.8 13.97,52.07 11.43,52.07 10.29,53.21 10.29,53.92 10.23,53.98 U4.27
  Bottom 0.254: v19.05,29.21 v15.24,29.21 | v58.42,9.14 v58.42,6.1 | v40.64,0.89 51.31,0.89 v53.34,2.92 | v18.03,16.26 v18.03,13.21
RX_ESP  (via drill 0.51)
  Top 0.254: U1.74 70.28,50.5 v69.85,50.93 | v69.85,49.02 69.34,48.51 68.71,48.51 67.94,47.75 67.94,43.69 65.53,41.27 v65.53,34.29
  Bottom 0.254: v69.85,50.93 v69.85,49.02 | v65.53,34.29 J11.1
RXD_AVR
  Top 0.254: IC2.1 16.59,54.86 16,54.86 15.32,54.18 14.73,54.18 | U4.31 13.43,54.31 13.56,54.18 14.73,54.18 | J9.3 21.59,46.99 14.73,53.85 14.73,54.18
RXD_CTRL
  Top 0.254: U4.2 15.76,57.66 17.27,57.66 18.32,56.61 18.32,55.93 | 18.32,55.93 IC2.6 | 18.32,55.93 R2.1
RXD_FPGA  (via drill 0.51)
  Top 0.254: U1.56 70.04,59.5 69.85,59.69 63.31,59.69 62.77,60.23 58.96,60.23 57.15,58.42 52.07,58.42 45.72,52.07 v41.91,52.07 | v38.1,52.07 31.75,52.07 30.48,50.8 30.48,49.53 27.94,46.99 24.13,46.99 | 24.13,46.99 22.61,46.99 16.62,52.97 IC2.3 | 24.13,45.47 J9.4 24.13,46.99
  Bottom 0.254: v38.1,52.07 v41.91,52.07
RXD_UART  (via drill 0.51)
  Top 0.254: IC2.4 18.32,52.8 v18.8,52.32 | v16.26,49.78 16.26,43.56 J9.1 16.38,43.18 16.38,19.96 U2.5
  Bottom 0.254: v18.8,52.32 v16.26,49.78
SCLK  (via drill 0.51)
  Top 0.254: U3.6 55.24,71.75 55.88,71.12 v58.42,71.12 63.5,71.12 64.26,71.88 71.37,71.88 74.17,69.09 74.17,66.97 75.01,66.13 75,66.12 U1.48 | v59.18,74.93 57.87,74.93 57.36,75.44 48.26,75.44 46.48,73.66 v46.35,73.66 32.47,73.66 29.42,70.61 21.38,70.61 17.82,74.17 16,74.17 15.24,74.93 15.09,74.93 14.71,75.31 13.23,75.31 11.71,73.79 J2.3 10.16,72.52 10.16,69.85 6.86,66.55 6.86,63.54 7.14,63.26 U4.17 | RN7.5 v46.35,68.58
  Bottom 0.254: v59.18,74.93 58.42,74.17 v58.42,71.12 | v46.35,68.58 v46.35,73.66
TX_ESP  (via drill 0.51)
  Top 0.254: U1.73 71.17,51 v69.85,52.32 | v67.06,50.16 65.53,51.69 59.69,51.69 58.42,50.42 J11.8
  Bottom 0.254: v69.85,52.32 67.69,50.16 v67.06,50.16
TXD  (via drill 0.51)
  Top 0.254: U2.1 16.51,17.36 17.65,18.51 17.65,28.79 18.16,29.29 18.16,29.58 18.29,29.7 18.29,38.61 19.05,39.37 | 19.05,39.37 J9.2 19.05,48.51 14.11,53.45 13.32,53.45 12.63,54.14 U4.30 | v38.1,50.8 33.02,50.8 31.75,49.53 31.75,48.26 29.21,45.72 29.21,44.45 24.13,39.37 19.05,39.37 | v41.91,50.8 45.72,50.8 52.07,57.15 57.15,57.15 59.05,59.05 62.87,59.05 63.37,58.55 69.72,58.55 70.18,59 U1.57
  Bottom 0.254: v38.1,50.8 v41.91,50.8
UART_RST  (via drill 0.51)
  Top 0.254: U4.28 11.03,53.74 v11.43,53.34 | v8.89,48.26 12.19,44.96 12.19,41.13 12.32,41.01 12.32,38.99 10.16,36.83 5.08,36.83 3.81,35.56 3.81,31.75 2.11,30.05 1.39,30.05 0.91,29.57 0.91,25.93 1.1,25.74 1.1,19.98 0.91,19.79 0.91,18.31 1.1,18.12 2.2,18.12 v2.54,17.78 | v4.7,17.78 4.7,16.89 5.71,15.88 | 5.71,15.88 6.35,15.24 7.62,15.24 8.89,16.51 8.89,20.32 8.26,20.95 8.26,22.23 7.26,23.21 U2.19 | R9.1 5.45,15.61 5.71,15.88
  Bottom 0.254: v11.43,53.34 11.43,50.8 v8.89,48.26 | v2.54,17.78 v4.7,17.78
VBATT  (via drill 0.51)
  Top 0.254: R28.2 67.31,19.05 68.58,20.32 68.58,21.59 67.31,22.86 60.96,22.86 60.64,22.54 Q2.2 | BT1.1 66.78,9.43 v64.04,9.43 | v63.5,1.27 v55.88,1.27 | v39.5,1.91 19.68,1.91 19.05,2.54 19.05,12.7 v19.56,13.21 | v19.56,16.26 19.56,27.43 v19.18,27.81 | U4.26 9.43,54.06 9.78,53.71 9.78,52.45 11.43,50.8 12.7,50.8 14.1,49.4 14.1,39.24 14.86,38.48 14.86,36.83 13.97,35.94 13.97,27.94 14.1,27.81 v15.37,27.81
  Top 0.508: BT1.1 68.78,12.5 68.58,12.7 54.61,12.7 53.72,13.59 53.72,15.62 54.61,16.51 54.61,19.05 56.13,20.57 56.64,20.57 57.15,21.08 57.15,22.35 57.34,22.54 Q2.2
  Bottom 0.254: v64.04,9.43 64.04,1.81 v63.5,1.27 | v55.88,1.27 54.23,2.92 54.23,3.29 53.71,3.81 41.4,3.81 v39.5,1.91 | v19.56,13.21 v19.56,16.26 | v19.18,27.81 v15.37,27.81
VBATTTIMED
  Top 0.508: L1.P$1 36.83,26.67 39.37,24.13 52.07,24.13 54.61,21.59 Q2.3
VCC_12  (via drill 0.51)
  Top 0.254: U1.11 83.94,55 83.82,55.12 | 73.09,48.83 74.36,50.1 | U1.61 76.05,57 76.2,57.15 | 81.5,62.01 U1.35 | U1.77 74.5,49.96 74.36,50.1 | v90.17,69.85 90.17,69.48 | 74.36,50.1 75.35,51.08 | 72.33,63.44 74.42,61.34 | 88.9,74.93 86.54,77.29 J8.2
  Top 0.508: C5.1 C1.1 70.75,65.01 72.33,63.44 72.83,62.93 | C6.1 C2.1 71.26,46.99 73.09,48.83 | C7.1 C3.1 89.02,46.99 83.82,52.19 83.82,55.12 83.82,55.88 | 76.2,55.88 76.2,57.15 76.2,59.56 74.42,61.34 | 76.2,55.88 76.2,51.93 75.35,51.08 75.35,50.9 | 83.82,60.96 83.82,55.88 | 83.82,60.96 85.09,60.96 89.27,65.14 C4.1 C9.1 90.17,69.48 | 83.82,60.96 82.55,60.96 81.5,62.01 | U9.2 90.17,76.2 88.9,74.93 v88.9,72.39 | 83.82,55.88 76.2,55.88
  Bottom 0.508: v88.9,72.39 88.9,71.12 v90.17,69.85
VCC_33  (via drill 0.51)
  Top 0.254: 68.58,50 U1.75 73.19,50 74.84,51.65 74.84,52.82 73.66,54 | 83.5,65.72 U1.31 83.5,62.83 84.23,62.1 v84.71,62.1 | 93.08,70.75 92.71,71.12 | 82,49.53 U1.92 82,46.99 | U1.88 80.01,48.81 79.97,48.85 79.97,49.9 80.38,49.9 80.64,50.16 | 72.39,67.31 74,65.7 U1.50 74,62.65 76.07,60.58 77.47,60.58 | U1.38 v80.01,60.58 77.47,60.58 | U1.14 v85.74,56.5 85.09,57.15 v85.09,59.69 85.9,60.5 U1.22 88.95,60.5 93.08,64.63 C17.1 | U1.67 73.66,54 | 82,49.53 81.36,50.16 80.64,50.16 | U1.58 73.58,58.5 74.17,57.91 v74.55,57.91 | v74.55,56.01 74.55,54.89 73.66,54 | v83.44,50.93 82.04,49.53 82,49.53 | C10.1 66.94,68.95 66.04,69.85 64.77,69.85 62.23,67.31 59.69,67.31 57.15,64.77 55.24,64.77 | 55.24,64.77 52.07,64.77 50.8,66.04 | 50.8,66.04 50.8,69.85 52.7,71.75 U3.8 U3.7 | v77.47,57.91 77.47,60.58 | v77.47,54.61 80.64,51.44 80.64,50.16 | U3.3 55.24,64.77 | U4.18 8.16,61.69 8.89,60.96 | U4.20 8.02,60.09 8.89,60.96 | Y2.1 Y2.4 84.97,67.43 85.09,67.31 | RN7.1 RN7.2 RN7.3 RN7.4 49.8,65.04 50.8,66.04 | 8.89,60.96 10.16,60.96 10.23,60.89 U4.6 | C23.1 C22.1 12.7,26.3 12.7,19.3 12.71,19.32 U2.4 13.13,19.32 | C16.1 93.08,49.53 91.55,49.53 91.43,49.66 90.69,49.66 90.56,49.53 90.17,49.53 88.9,50.8 88.9,52.5 U1.6 86.76,52.5 86.17,53.09 85.6,53.09 v85.09,52.58 | 18.29,54.23 19.43,54.23
  Top 0.508: C14.1 C10.1 66.94,69.48 67.31,69.85 71.25,69.85 72.39,68.71 72.39,67.31 | C11.1 C15.1 66.94,48.36 68.58,50 | C16.1 C12.1 93.08,43.55 92.46,42.93 88.14,42.93 85.34,45.72 83.27,45.72 82,46.99 | C17.1 C13.1 93.08,70.75 | 83.5,65.72 85.09,67.31 87.63,67.31 87.63,69.85 88.9,71.12 92.71,71.12 92.15,71.68 U9.3
  Top 1.016: 53.34,38.1 49.53,34.29 35.56,34.29 33.02,31.75 33.02,27.94 39.37,21.59 49.53,21.59 52.07,19.05 D14.C | 53.34,38.1 53.34,46.67 59.25,52.58 66.8,52.58 68.58,50.8 68.58,50 | D13.C 55,28.33 55.88,29.21 55.88,35.56 53.34,38.1
  Bottom 0.254: 85.09,60.71 80.14,60.71 v80.01,60.58 | v84.71,62.1 85.09,61.72 85.09,60.71 | 85.09,60.71 v85.09,59.69 | v85.09,52.58 84.84,52.32 | 84.84,52.32 v83.44,50.93 | v11.94,66.42 13.97,68.45 J2.2 | v85.74,56.5 85.71,56.5 83.82,54.61 83.82,53.34 84.84,52.32 | v10.16,15.24 10.16,15.49 v12.06,17.4 | v7.24,54.74 7.24,56.39 v8.89,58.04 | v74.55,57.91 v74.55,56.01 75.95,54.61 v77.47,54.61 v77.47,57.91 v74.55,57.91
  pour Top: 0,80.01 0,0 100.33,0 100.33,80.01
VUSB  (via drill 0.51)
  Top 0.254: IC1.8 14.61,5.71 v14.73,5.84 15.75,6.86 15.75,11.11 14.92,11.94 13.46,11.94 12.7,12.7 3.81,12.7 3.44,13.07 C19.1 C20.1 | U2.20 4.79,22.57 3.44,21.22 R7.2 C20.1 | C20.1 3.44,17.41 | J4.1 22.86,10.16
  Top 0.508: U7.3 31.75,5.31 30.48,6.58 30.48,8.89 29.21,10.16 22.86,10.16 21.59,10.16 20.32,8.89 v20.32,5.21
  Bottom 0.508: v20.32,5.21 15.37,5.21 v14.73,5.84
VUSB_HALF  (via drill 0.51)
  Top 0.254: v8.64,53.21 v8.63,53.22 U4.25 | R7.1 1.64,19.95 1.61,19.98 1.61,24.3 1.64,24.33 R8.2 3.81,28.84 3.81,31.03 4.32,31.54 4.32,35.35 5.29,36.32 10.37,36.32 10.88,36.83 11.43,36.83 12.83,38.23 12.83,45.97 v8.64,50.16
  Bottom 0.254: v8.64,53.21 v8.64,50.16
XT1  (1 unrouted)
  Top 0.254: U4.7 16.86,61.69 17.4,62.23 24.13,62.23 25.13,61.23 Y1.3
XT2  (1 unrouted)
  Top 0.254: U4.8 16.77,62.49 17.27,62.99 24.13,62.99 24.37,63.23 Y1.1